# EAGLE design önlab (EAGLE 7.1.0)
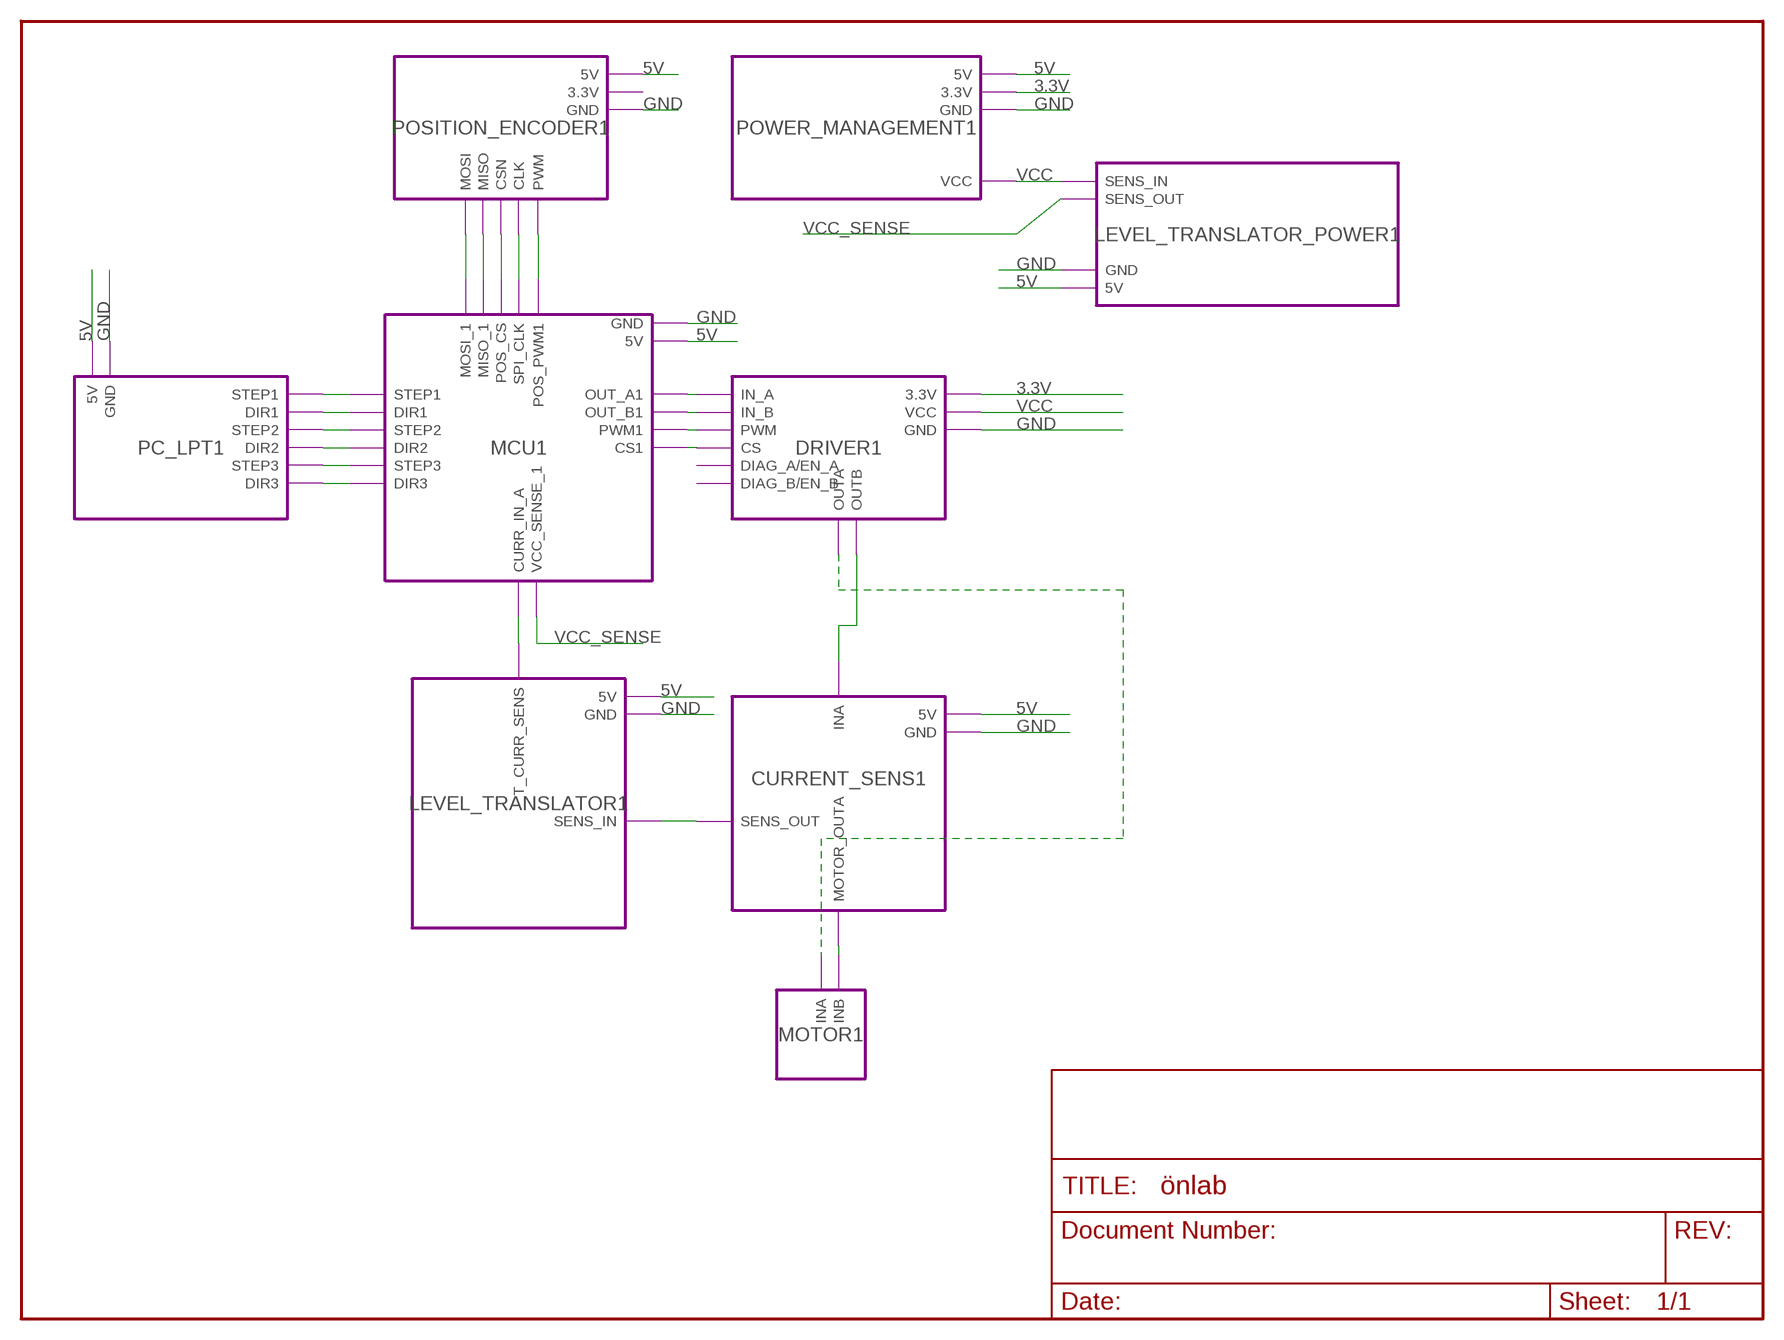
[diagram p0: schematic, sheet 1]

## Module instances
PC_LPT1 = PC_LPT
MCU1 = MCU
DRIVER1 = DRIVER
CURRENT_SENS1 = CURRENT_SENS
POSITION_ENCODER1 = POSITION_ENCODER
LEVEL_TRANSLATOR1 = LEVEL_TRANSLATOR
POWER_MANAGEMENT1 = POWER_MANAGEMENT
MOTOR1 = MOTOR
LEVEL_TRANSLATOR_POWER1 = LEVEL_TRANSLATOR_POWER

## Nets
3.3V: port POWER_MANAGEMENT1.3.3V DRIVER1.3.3V
5V: port POWER_MANAGEMENT1.5V LEVEL_TRANSLATOR_POWER1.5V POSITION_ENCODER1.5V CURRENT_SENS1.5V LEVEL_TRANSLATOR1.5V MCU1.5V PC_LPT1.5V
CS1: port DRIVER1.CS MCU1.CS1
GND: port POWER_MANAGEMENT1.GND LEVEL_TRANSLATOR_POWER1.GND POSITION_ENCODER1.GND CURRENT_SENS1.GND DRIVER1.GND LEVEL_TRANSLATOR1.GND MCU1.GND PC_LPT1.GND
N$1: port PC_LPT1.DIR3 MCU1.DIR3
N$2: port PC_LPT1.STEP3 MCU1.STEP3
N$3: port PC_LPT1.DIR2 MCU1.DIR2
N$4: port PC_LPT1.STEP2 MCU1.STEP2
N$5: port PC_LPT1.DIR1 MCU1.DIR1
N$6: port PC_LPT1.STEP1 MCU1.STEP1
N$7: port LEVEL_TRANSLATOR1.T_CURR_SENS MCU1.CURR_IN_A
N$8: port DRIVER1.OUTB CURRENT_SENS1.INA
N$9: port DRIVER1.OUTA MOTOR1.INA
N$10: port CURRENT_SENS1.MOTOR_OUTA MOTOR1.INB
N$14: port CURRENT_SENS1.SENS_OUT LEVEL_TRANSLATOR1.SENS_IN
N$16: port POSITION_ENCODER1.MISO MCU1.MISO_1
N$17: port POSITION_ENCODER1.CLK MCU1.SPI_CLK
N$19: port POSITION_ENCODER1.PWM MCU1.POS_PWM1
N$21: port MCU1.MOSI_1 POSITION_ENCODER1.MOSI
N$22: port MCU1.POS_CS POSITION_ENCODER1.CSN
OUT_A1: port MCU1.OUT_A1 DRIVER1.IN_A
OUT_B1: port MCU1.OUT_B1 DRIVER1.IN_B
PWM1: port MCU1.PWM1 DRIVER1.PWM
VCC: port POWER_MANAGEMENT1.VCC LEVEL_TRANSLATOR_POWER1.SENS_IN DRIVER1.VCC
VCC_SENSE: port LEVEL_TRANSLATOR_POWER1.SENS_OUT MCU1.VCC_SENSE_1

## Library data of the parts

## Module PC_LPT
Ports: STEP1(out) DIR1(out) STEP2(out) DIR2(out) STEP3(out) DIR3(out) 5V(pwr) GND(pwr)
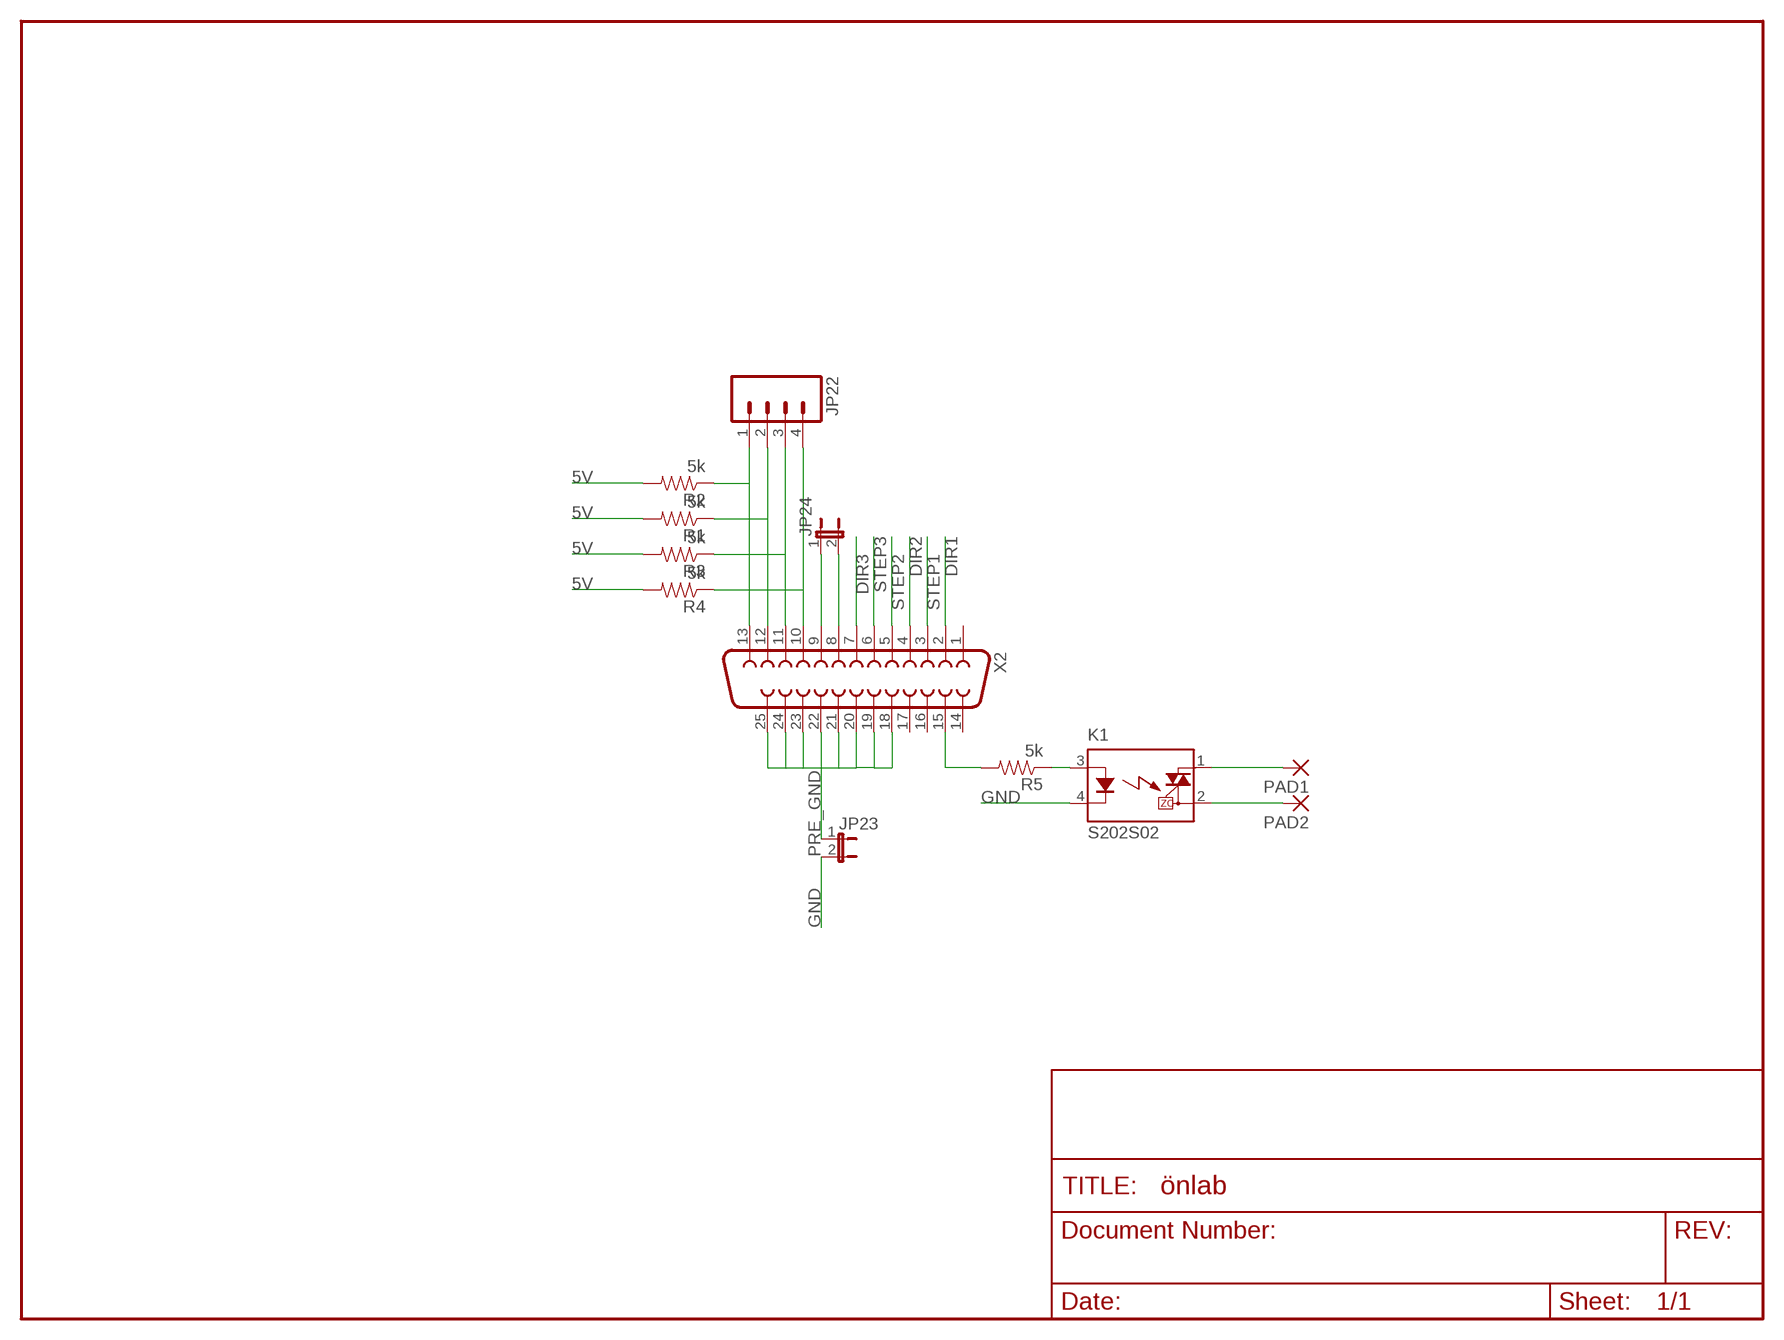
[diagram p1: schematic, module PC_LPT, sheet 1]

### Parts
JP22  M04PTH  [1X04]
JP23  JUMPER-2PTH  [1X02]
JP24  JUMPER-2PTH  [1X02]
K1  S202S02  [S202S02]
PAD1  3,81/1,1  [3,81/1,1]
PAD2  3,81/1,1  [3,81/1,1]
R1  5k  RESISTOR1206  [1206]
R2  5k  RESISTOR1206  [1206]
R3  5k  RESISTOR1206  [1206]
R4  5k  RESISTOR1206  [1206]
R5  5k  RESISTOR1206  [1206]
X2  F25H  [F25H]

### Nets
5V: R1.2 R2.2 R3.2 R4.2
DIR1: X2.2
DIR2: X2.4
DIR3: X2.7
GND: JP23.2 K1.4(K)
N$12: JP22.4 R4.1 X2.10
N$28: JP22.3 R3.1 X2.11
N$31: JP22.2 R1.1 X2.12
N$34: JP22.1 R2.1 X2.13
N$41: K1.3(A) R5.1
N$42: R5.2 X2.15
N$43: K1.2(DS2) PAD2.1(P)
N$44: K1.1(DS1) PAD1.1(P)
N$45: JP24.1 X2.9
N$46: JP24.2 X2.8
PRE_GND: JP23.1 X2.18 X2.19 X2.20 X2.21 X2.22 X2.23 X2.24 X2.25
STEP1: X2.3
STEP2: X2.5
STEP3: X2.6
Unconnected: X2.1 X2.14 X2.16 X2.17

### Library data of the parts
JP22 = SparkFun:M04: Header 4 Standard 4-pin 0.1" header. Use with straight break away headers (SKU : PRT-00116), right angle break away headers (PRT-00553), swiss pins (PRT-00743), machine pins (PRT-00117), and female headers (PRT-00115). Molex polarized connector foot print use with SKU : PRT-08231 with associated crimp pins and housings.
JP23 JP24 = SparkFun-Retired:JUMPER-2: Jumper Basic 0.1" spaced jumper. Use with breakaway headers.
K1 = relay:S*02S02: IT(rms) 8A, Zero Cross type SIP 4pin Triac output SSR Source: http://sharp-world.com/products/device/lineup/data/pdf/datasheet/s102s02_e.pdf
PAD1 PAD2 = wirepad:3,81/1,1: THROUGH-HOLE PAD
R1-R5 = SparkFun:RESISTOR: Resistor Basic schematic elements and footprints for 0603, 1206, and PTH 1/10th watt (small) resistors.
X2 = SparkFun-Connectors:F25: 25 Pin male connector. PCB edge mount for regular PCB thicknesses. This connector will connect directly to the back of a PC parallel port or through a normal DB25 extension cable (M/F). SKU: PRT-08287

## Module MCU
Ports: STEP1(in) DIR1(in) STEP2(in) DIR2(in) STEP3(in) DIR3(in) OUT_A1(out) OUT_B1(out) PWM1(out) CURR_IN_A(in) MOSI_1(out) MISO_1(in) SPI_CLK(out) POS_CS(out) VCC_SENSE_1(in) CS1(out) GND(pwr) 5V(pwr) POS_PWM1(in)
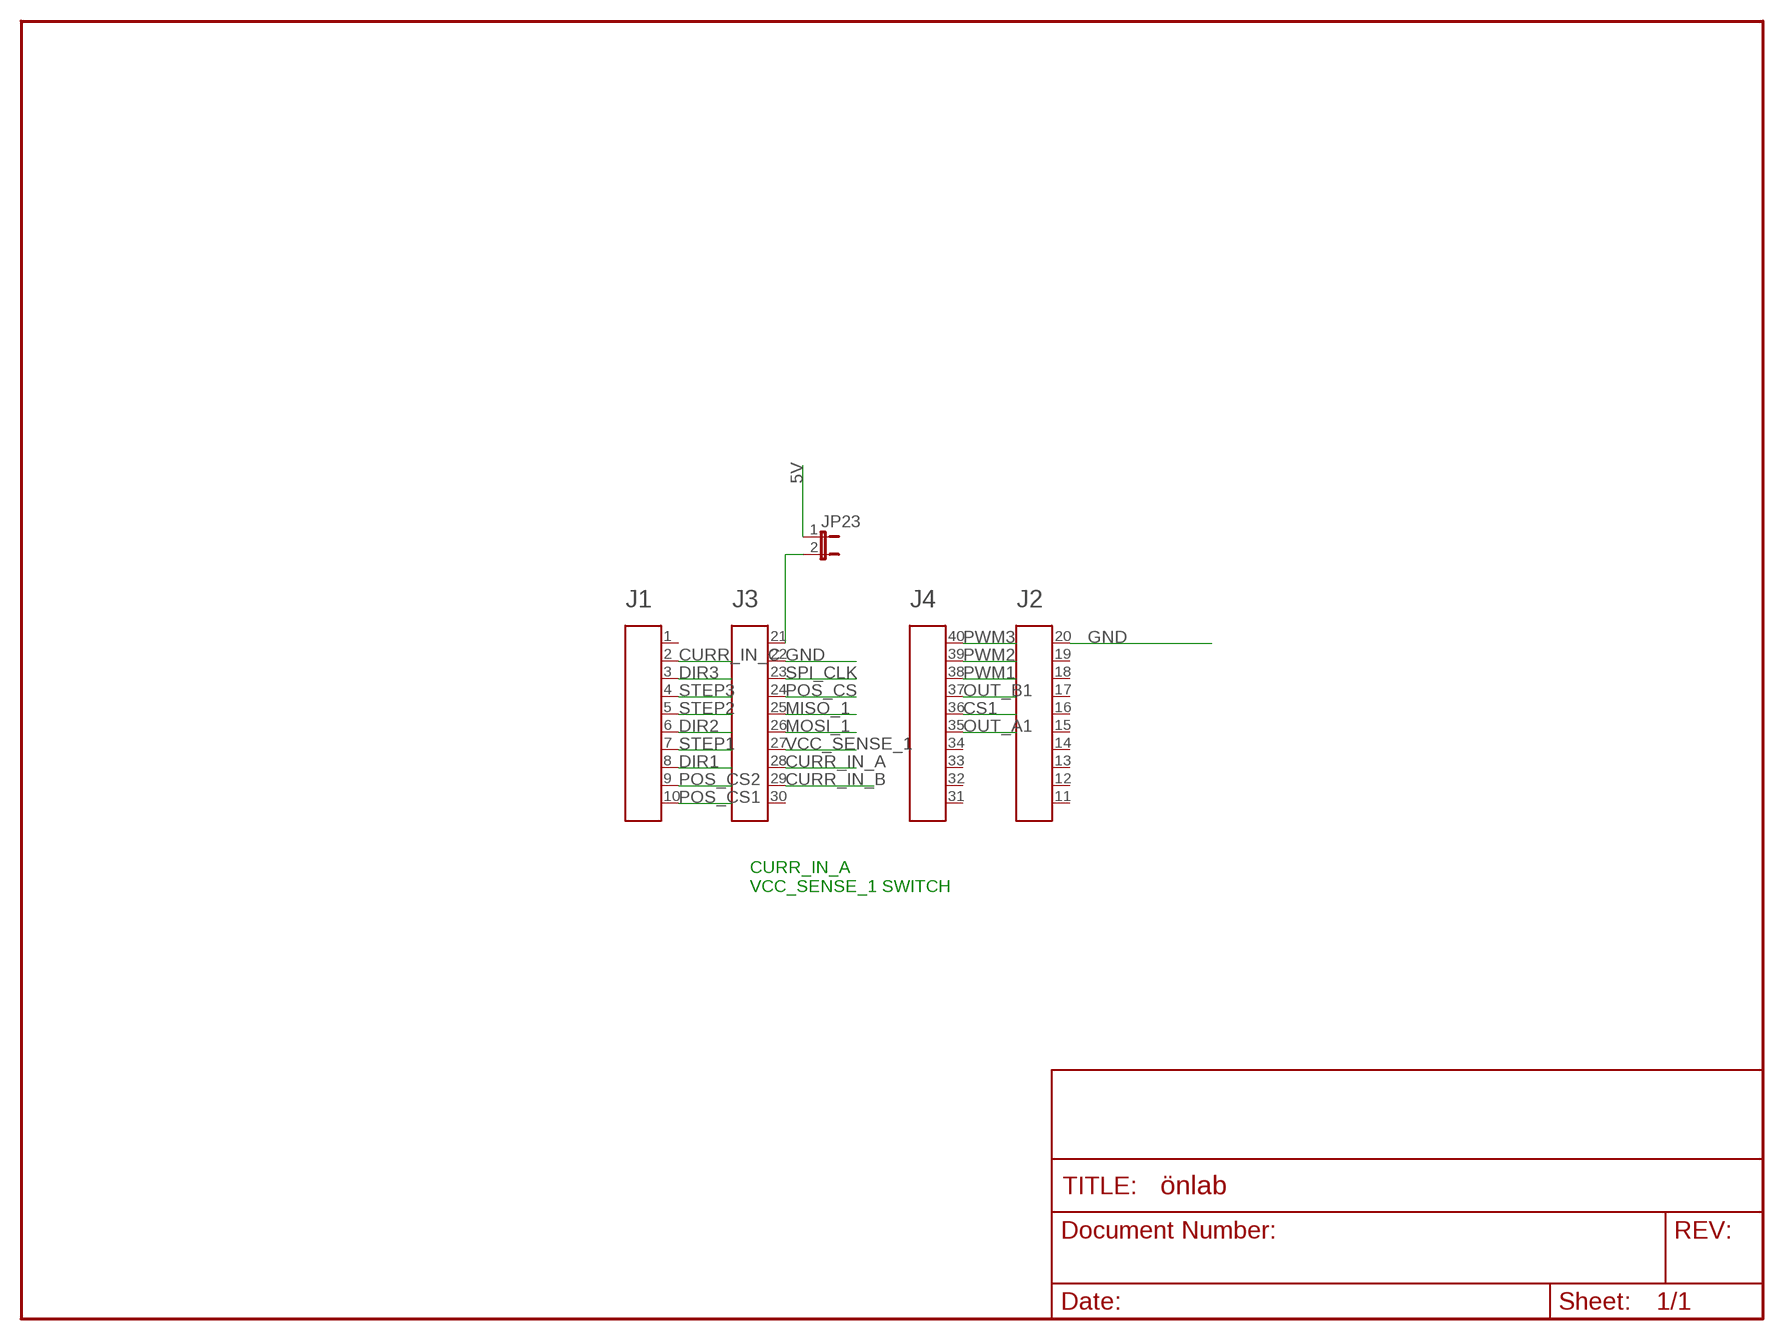
[diagram p2: schematic, module MCU, sheet 1]

### Parts
A1  HEADER4X10-BOOSTERPACK  [4X10-BOOSTERPACK]
JP23  JUMPER-2PTH  [1X02]

### Nets
5V: JP23.1
CS1: A1.36
CURR_IN_A: A1.28
CURR_IN_B: A1.29
CURR_IN_C: A1.2
DIR1: A1.8
DIR2: A1.6
DIR3: A1.3
GND: A1.20 A1.22
MISO_1: A1.25
MOSI_1: A1.26
N$1: A1.21 JP23.2
OUT_A1: A1.35
OUT_B1: A1.37
POS_CS: A1.24
POS_CS1: A1.10
POS_CS2: A1.9
PWM1: A1.38
PWM2: A1.39
PWM3: A1.40
SPI_CLK: A1.23
STEP1: A1.7
STEP2: A1.5
STEP3: A1.4
VCC_SENSE_1: A1.27
Unconnected: A1.1 A1.11 A1.12 A1.13 A1.14 A1.15 A1.16 A1.17 A1.18 A1.19 A1.30 A1.31 A1.32 A1.33 A1.34

### Notes on the sheet
- CURR_IN_A
  VCC_SENSE_1 SWITCH

### Library data of the parts
A1 = EAGLE_BoosterPack_Library:HEADER4X10-BOOSTERPACK
JP23 = SparkFun-Retired:JUMPER-2: Jumper Basic 0.1" spaced jumper. Use with breakaway headers.

## Module DRIVER
Ports: IN_A(in) IN_B(in) PWM(in) DIAG_A/EN_A(io) DIAG_B/EN_B(io) VCC(pwr) GND(pwr) OUTA(out) OUTB(out) 3.3V(pwr) CS(in)
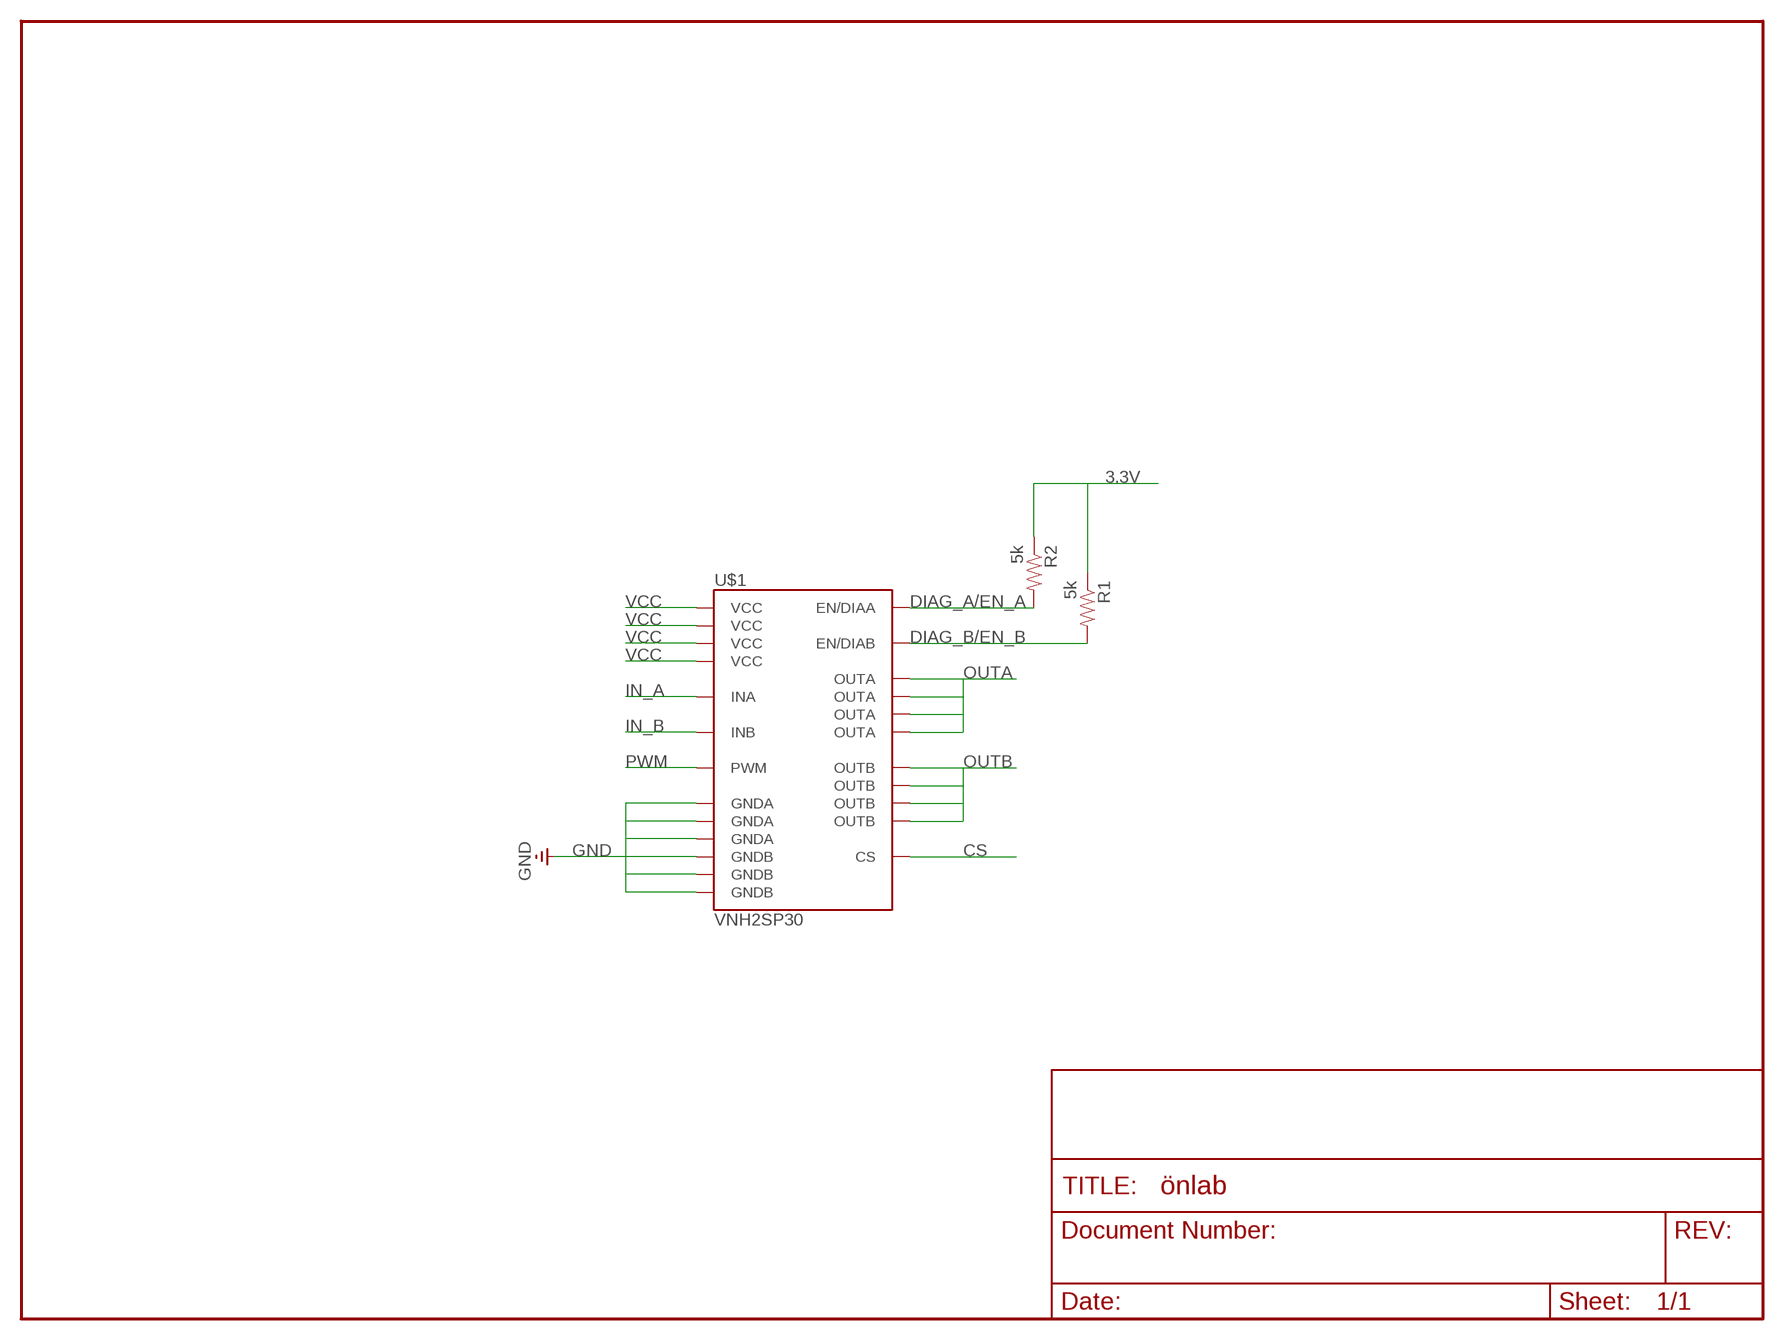
[diagram p3: schematic, module DRIVER, sheet 1]

### Parts
R1  5k  RESISTOR1206  [1206]
R2  5k  RESISTOR1206  [1206]
U$1  VNH2SP30  [VNH2SP30]

### Nets
3.3V: R1.1 R2.1
CS: U$1.9(CS)
DIAG_A/EN_A: R2.2 U$1.6(EN/DIAA)
DIAG_B/EN_B: R1.2 U$1.10(EN/DIAB)
GND: U$1.18(GNDB) U$1.19(GNDB) U$1.20(GNDB) U$1.26(GNDA) U$1.27(GNDA) U$1.28(GNDA)
IN_A: U$1.5(INA)
IN_B: U$1.11(INB)
OUTA: U$1.1(OUTA) U$1.25(OUTA) U$1.30(OUTA) U$1.SLUG3(OUTA)
OUTB: U$1.15(OUTB) U$1.16(OUTB) U$1.21(OUTB) U$1.SLUG2(OUTB)
PWM: U$1.8(PWM)
VCC: U$1.3(VCC) U$1.13(VCC) U$1.23(VCC) U$1.SLUG1(VCC)

### Library data of the parts
R1 R2 = SparkFun:RESISTOR: Resistor Basic schematic elements and footprints for 0603, 1206, and PTH 1/10th watt (small) resistors.
U$1 = SparkFun-PowerIC:VNH2SP30: 30A motor driver IC

## Module CURRENT_SENS
Ports: INA(in) MOTOR_OUTA(out) 5V(pwr) GND(pwr) SENS_OUT(out)
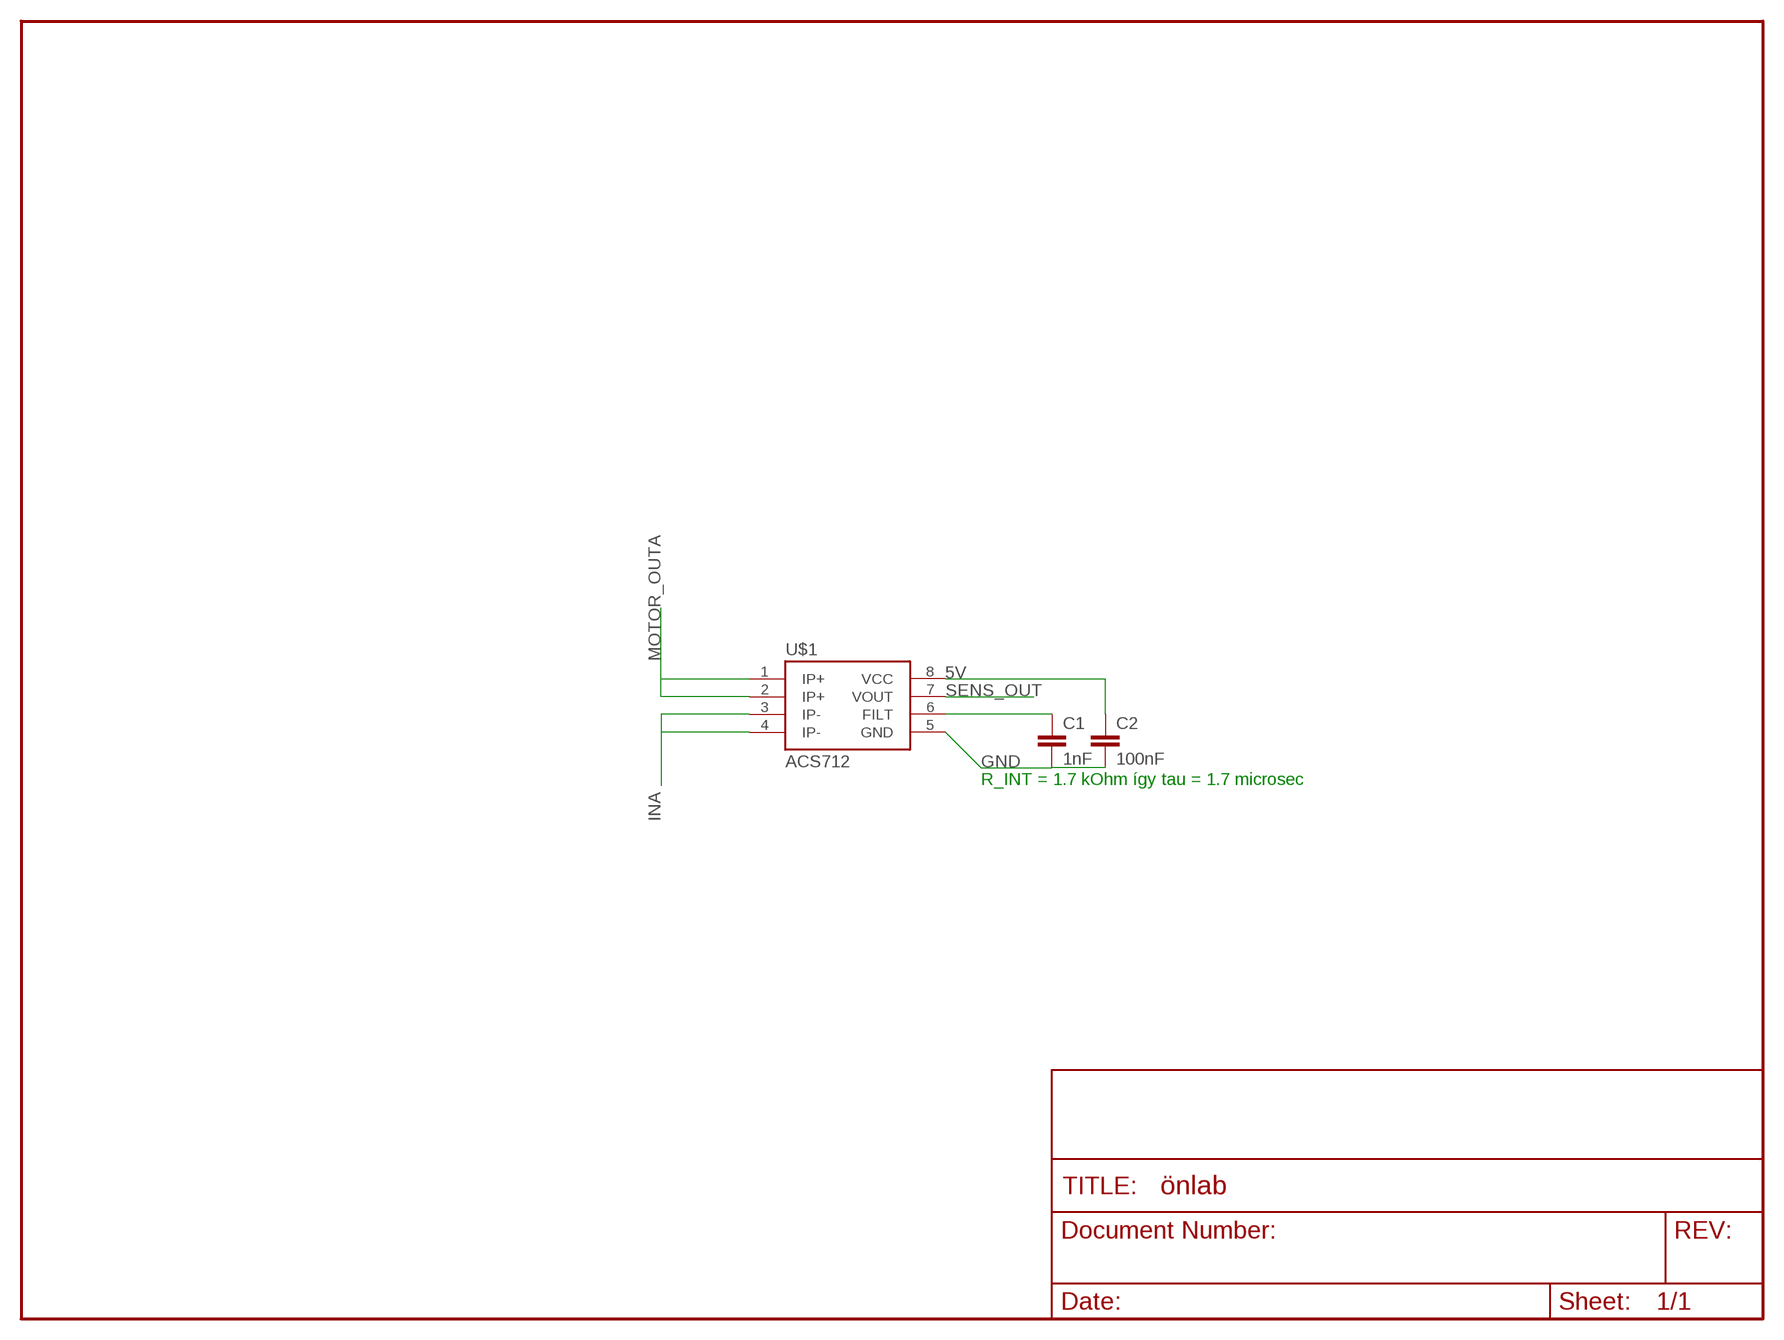
[diagram p4: schematic, module CURRENT_SENS, sheet 1]

### Parts
C1  1nF  CAP1206  [1206]
C2  100nF  CAP1206  [1206]
U$1  ACS712  [SO08]

### Nets
5V: C2.1 U$1.8(VCC)
GND: C1.2 C2.2 U$1.5(GND)
INA: U$1.3(IP-) U$1.4(IP-)
MOTOR_OUTA: U$1.1(IP+) U$1.2(IP+)
N$1: C1.1 U$1.6(FILT)
SENS_OUT: U$1.7(VOUT)

### Notes on the sheet
- R_INT = 1.7 kOhm így tau = 1.7 microsec

### Library data of the parts
C1 C2 = SparkFun-Passives:CAP: Capacitor Standard 0603 ceramic capacitor, and 0.1" leaded capacitor.
U$1 = SparkFun-AnalogIC:ACS712: Hall-effect-based isolated linear current sensor

## Module POSITION_ENCODER
Ports: 5V(pwr) 3.3V(pwr) GND(pwr) MOSI(in) MISO(out) CSN(in) CLK(in) PWM(out)
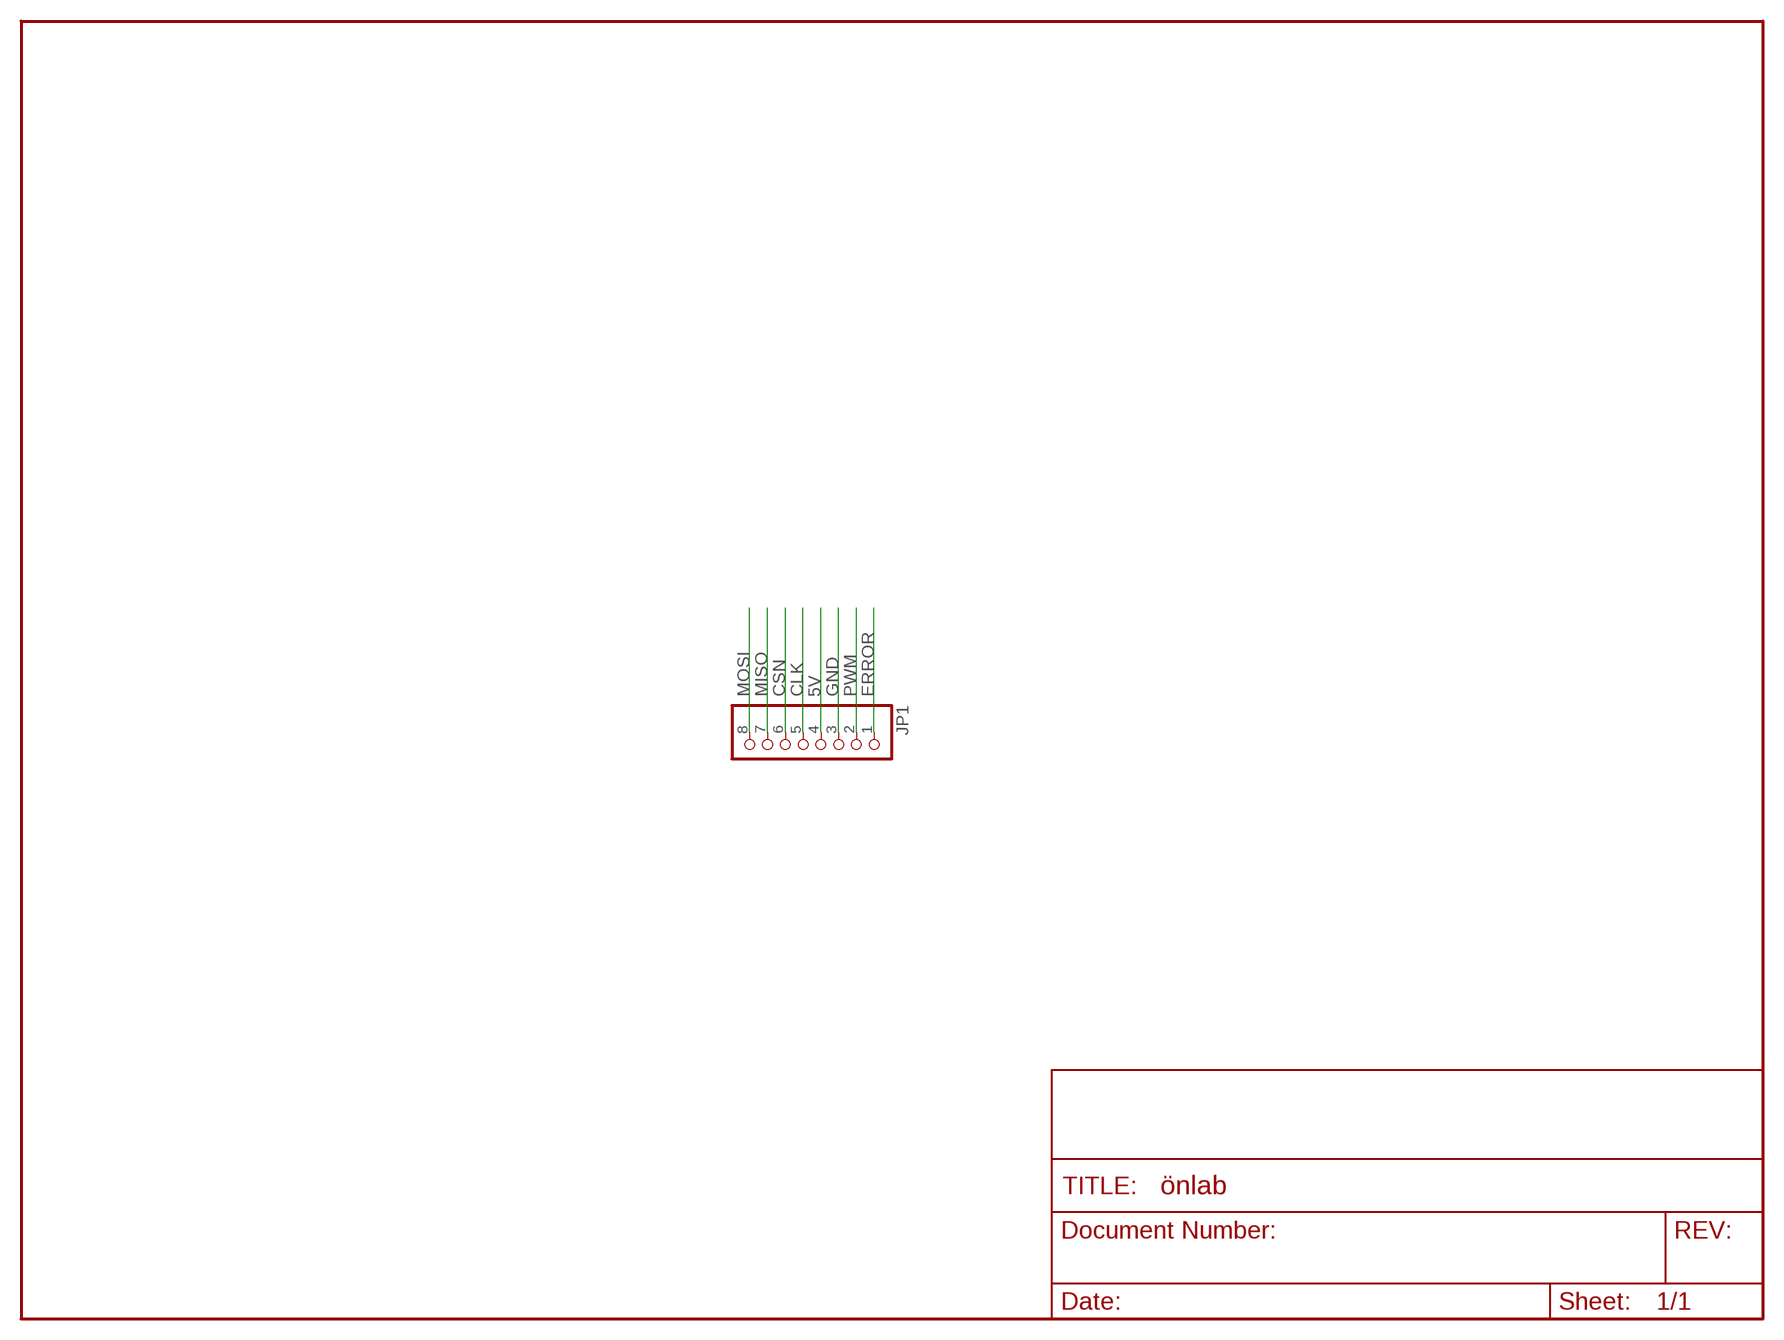
[diagram p5: schematic, module POSITION_ENCODER, sheet 1]

### Parts
JP1  PINHD-1X8M  [1X08M]

### Nets
5V: JP1.4
CLK: JP1.5
CSN: JP1.6
ERROR: JP1.1
GND: JP1.3
MISO: JP1.7
MOSI: JP1.8
PWM: JP1.2

### Library data of the parts
JP1 = pinhead:PINHD-1X8: PIN HEADER

## Module LEVEL_TRANSLATOR
Ports: 5V(pwr) GND(pwr) SENS_IN(in) T_CURR_SENS(out)
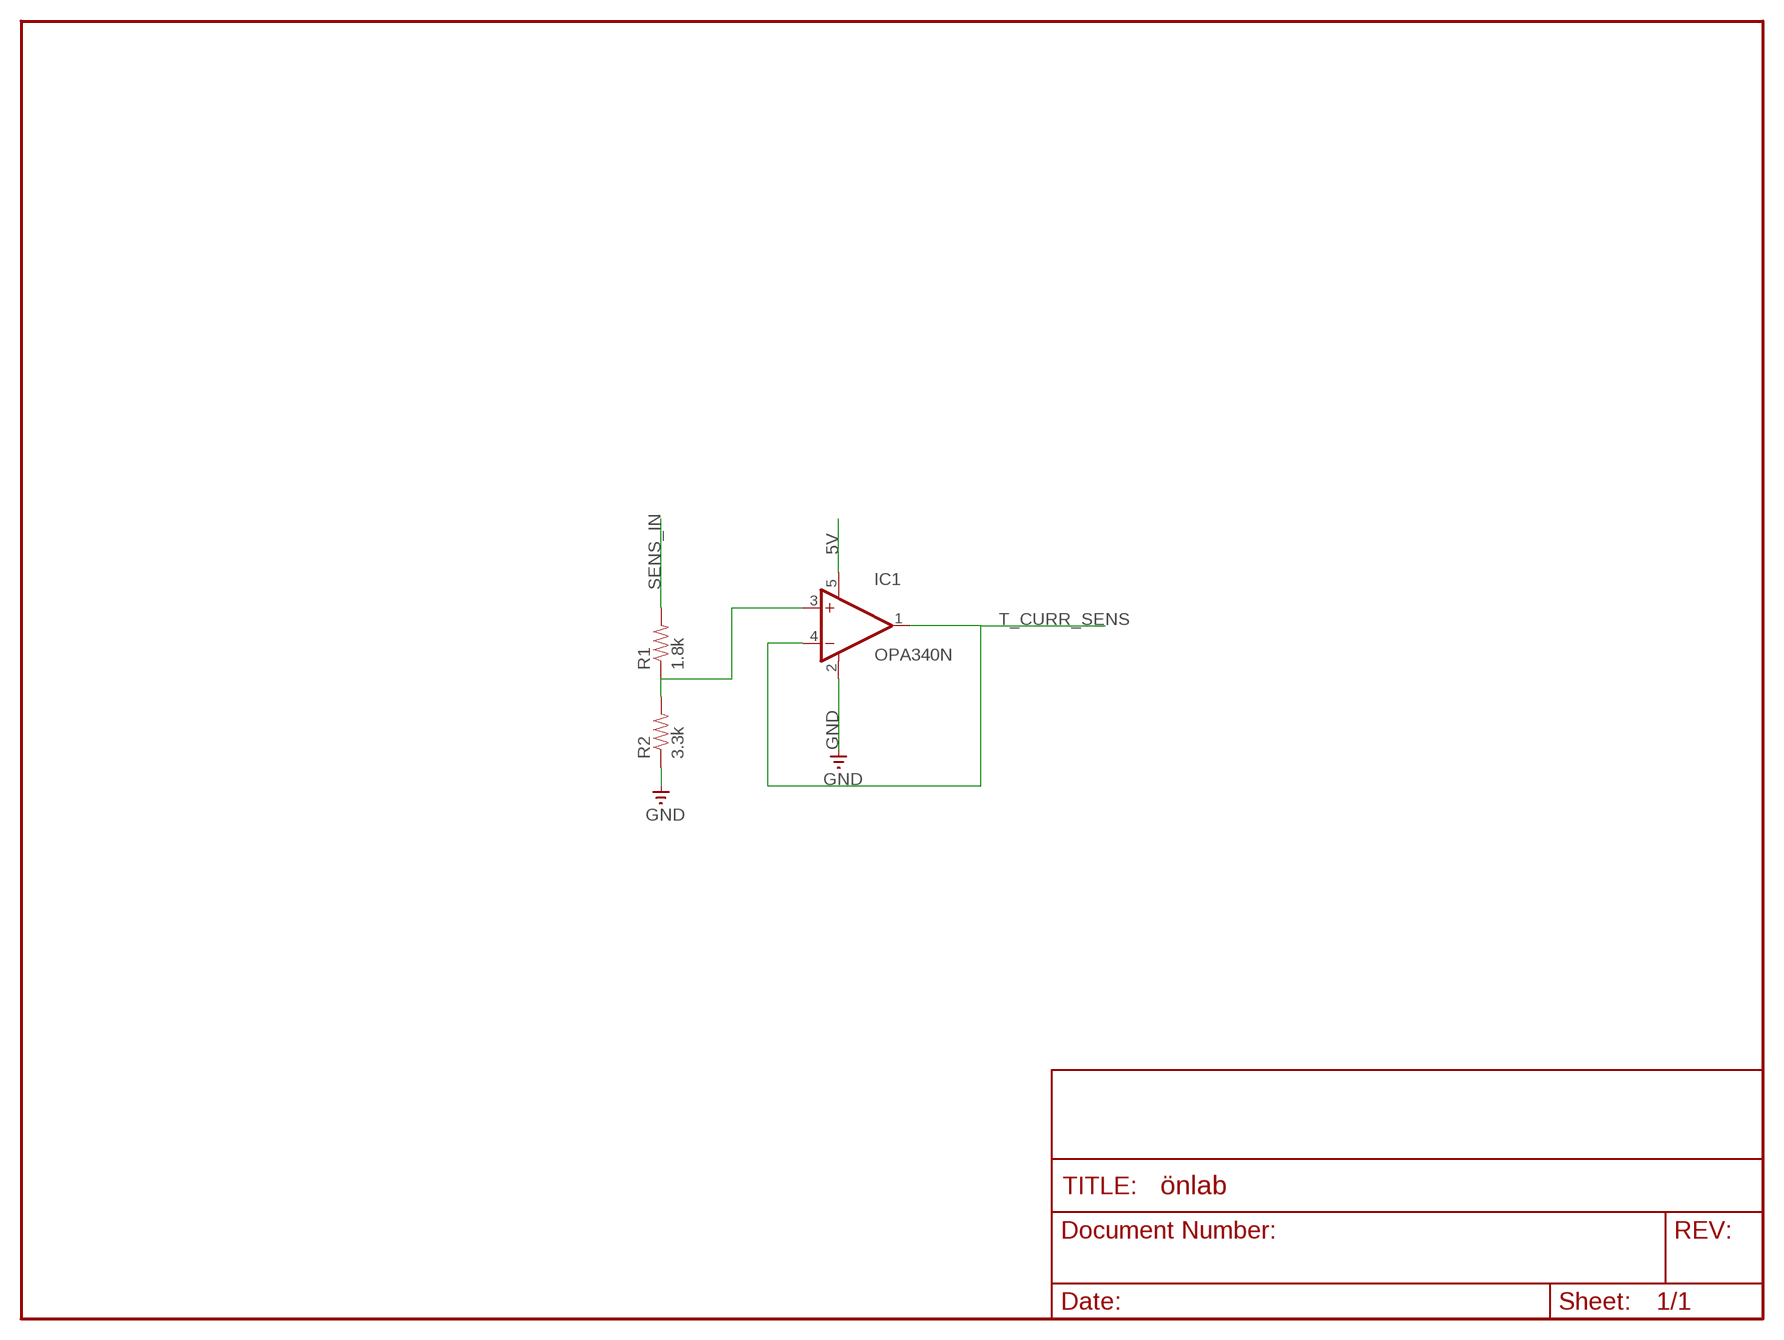
[diagram p6: schematic, module LEVEL_TRANSLATOR, sheet 1]

### Parts
IC1  OPA340N  [SOT23-5]
R1  1.8k  RESISTOR1206  [1206]
R2  3.3k  RESISTOR1206  [1206]

### Nets
5V: IC1.5(V+)
GND: IC1.2(V-) R2.1
N$1: IC1.3(+IN) R1.1 R2.2
SENS_IN: R1.2
T_CURR_SENS: IC1.1(OUT) IC1.4(-IN)

### Library data of the parts
IC1 = burr-brown:OPA340: Rail-to-Rail Operational Amplifiers Single-Supply, MicroAmplifier(TM) Series
R1 R2 = SparkFun:RESISTOR: Resistor Basic schematic elements and footprints for 0603, 1206, and PTH 1/10th watt (small) resistors.

## Module POWER_MANAGEMENT
Ports: 5V(pwr) 3.3V(pwr) GND(pwr) VCC(pwr)
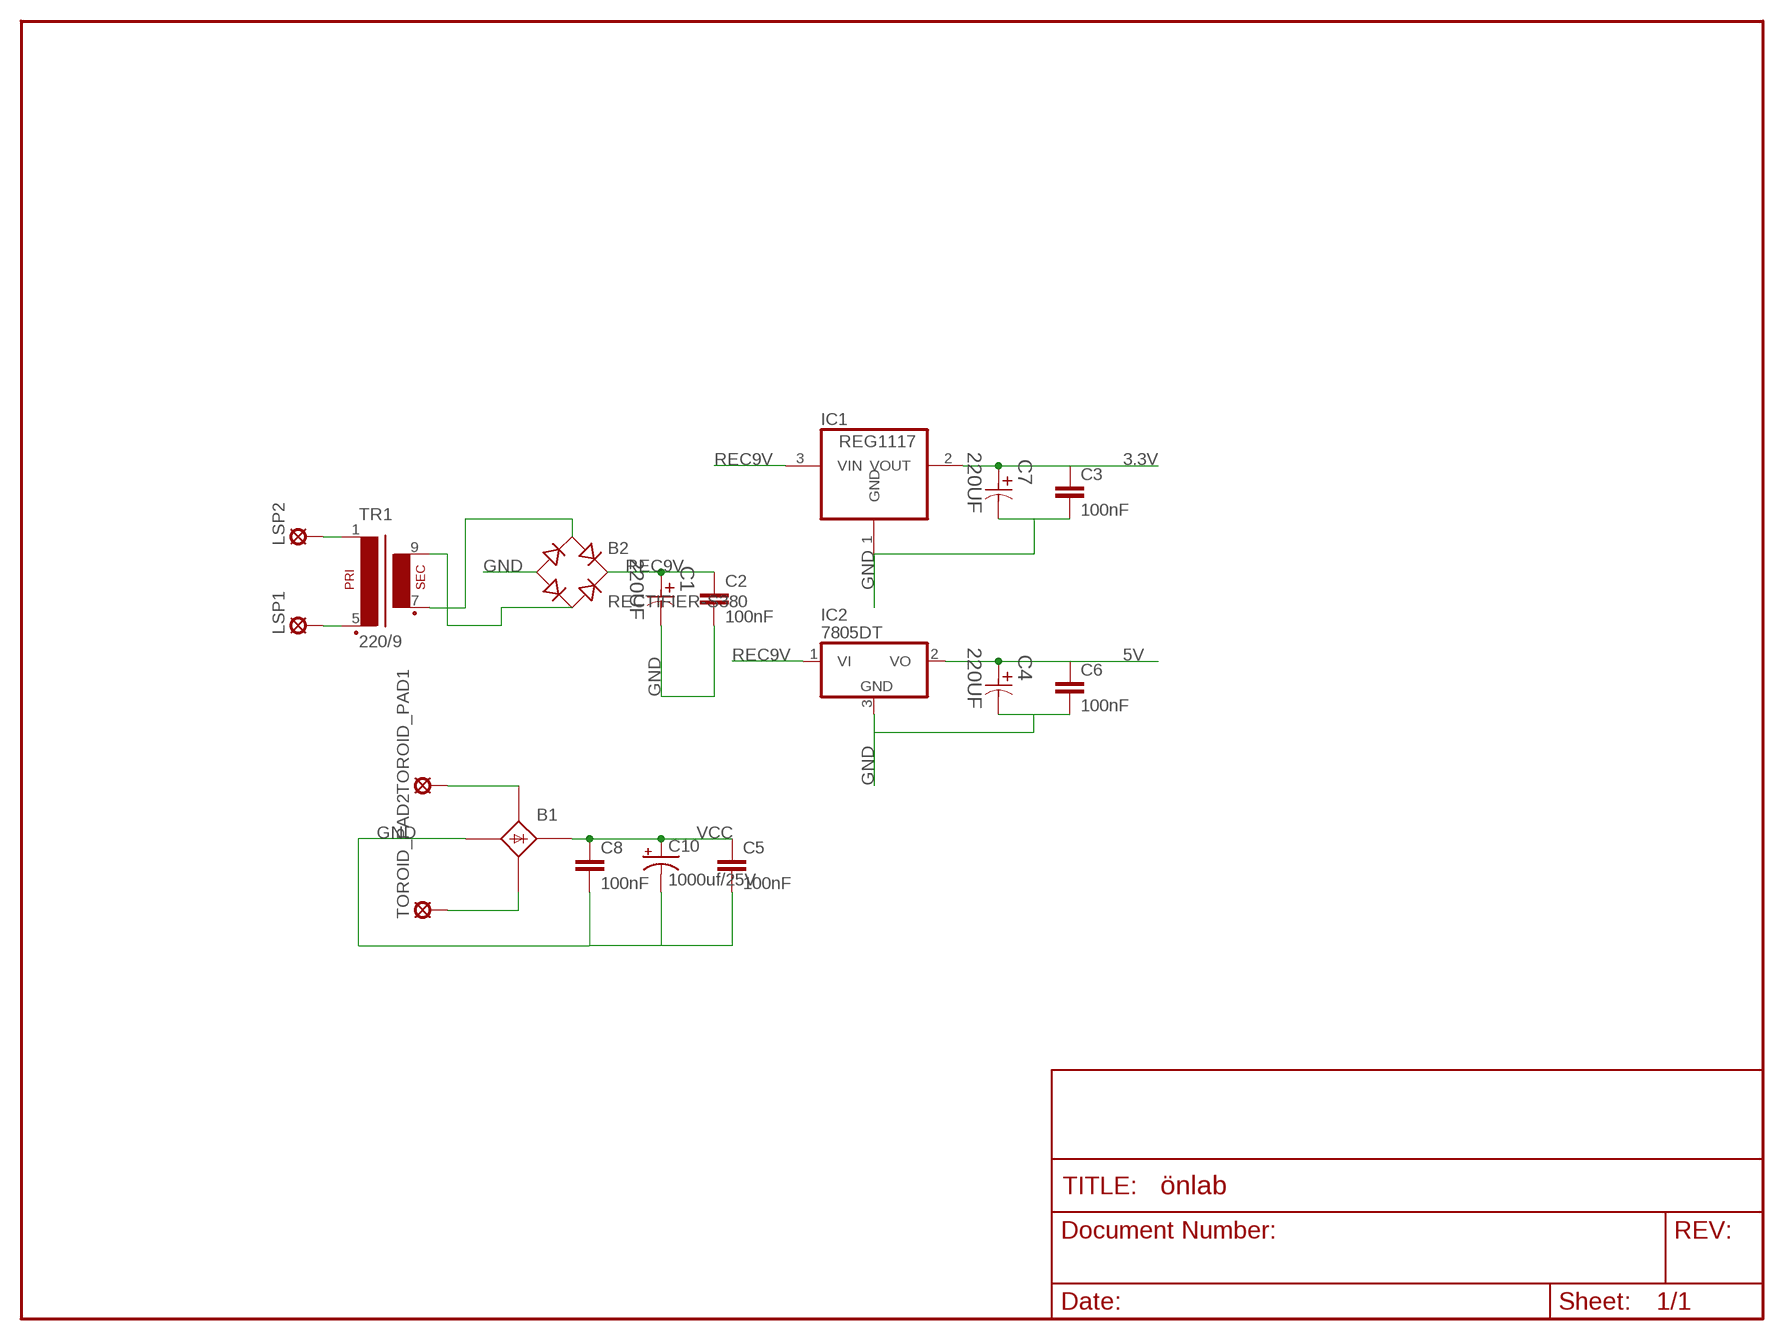
[diagram p7: schematic, module POWER_MANAGEMENT, sheet 1]

### Parts
B1  B25A-  [B25A-]
B2  RECTIFIER-S380  [TO-269AA]
C1  220UF  EEE-FK1C221P-CASE-E  [CAPAE830X650N]
C2  100nF  CAP1206  [1206]
C3  100nF  CAP1206  [1206]
C4  220UF  EEE-FK1C221P-CASE-E  [CAPAE830X650N]
C5  100nF  CAP1206  [1206]
C6  100nF  CAP1206  [1206]
C7  220UF  EEE-FK1C221P-CASE-E  [CAPAE830X650N]
C8  100nF  CAP1206  [1206]
C10  1000uf/25V  22000UF_ELCO_RM10KIT  [CPOL_RM10]
IC1  REG1117  [SOT223]
IC2  7805DT  [TO252]
LSP1  SE14  [SE14]
LSP2  SE14  [SE14]
TOROID_PAD1  SE14  [SE14]
TOROID_PAD2  SE14  [SE14]
TR1  220/9  EI30-1  [EI30-1]

### Nets
3.3V: C3.1 C7.1 IC1.2(VOUT)
5V: C4.1 C6.1 IC2.2(VO)
GND: B1.-1(-) B2.- C1.2 C2.2 C3.2 C4.2 C5.2 C6.2 C7.2 C8.2 C10.- IC1.1(GND) IC2.3(GND)
N$1: B1.AC2-(AC2) TOROID_PAD2.MP
N$2: B1.AC1-(AC1) TOROID_PAD1.MP
N$3: B2.AC1 TR1.7(S3)
N$4: B2.AC2 TR1.9(S4)
N$7: LSP2.MP TR1.1
N$8: LSP1.MP TR1.5(P2)
REC9V: B2.+ C1.1 C2.1 IC1.3(VIN) IC2.1(VI)
VCC: B1.+1(+) C5.1 C8.1 C10.+
Unconnected: B1.+ B1.- B1.AC1 B1.AC2

### Library data of the parts
B1 = rectifier:B25A-: RECTIFIER 25-A bridge
B2 = rectifier:RECTIFIER-: Rectifier
C1 C4 C7 = Panasonic-EEEFK_EEEFP:EEE-: Aluminum Electrolytic Capacitors,Surface Mount Type; MPN: EEE-FK1C221P; OC_FARNELL: 9695680; OC_NEWARK: 96K9382; PACKAGE: CASE-E; SUPPLIER: PANASONIC; TOLERANCE: ±20 %; VOLTAGERATING: 16V
C2 C3 C5 C6 C8 = SparkFun-Capacitors:CAP: Capacitor Standard 0603 ceramic capacitor, and 0.1" leaded capacitor.
C10 = forCNC:22000UF_ELCO_RM10: CAP-08070; PROD_ID: CAP-09538
IC1 = burr-brown-3:REG1117: 800mA and 1A Low Dropout (LDO) Positive Regulator 1.8V, 2.5V, 2.85V, 3.3V, 5V, and Adj
IC2 = linear4:78*: Positive VOLTAGE REGULATOR
LSP1 LSP2 TOROID_PAD1 TOROID_PAD2 = solpad:SE14: SOLDER PAD E1553, drill 1,4mm, distributor Buerklin, 07F820
TR1 = trafo:EI30-1: TRANSFORMER 1 primary winding, 1 secondary winding ERA

## Module MOTOR
Ports: INA(in) INB(in)
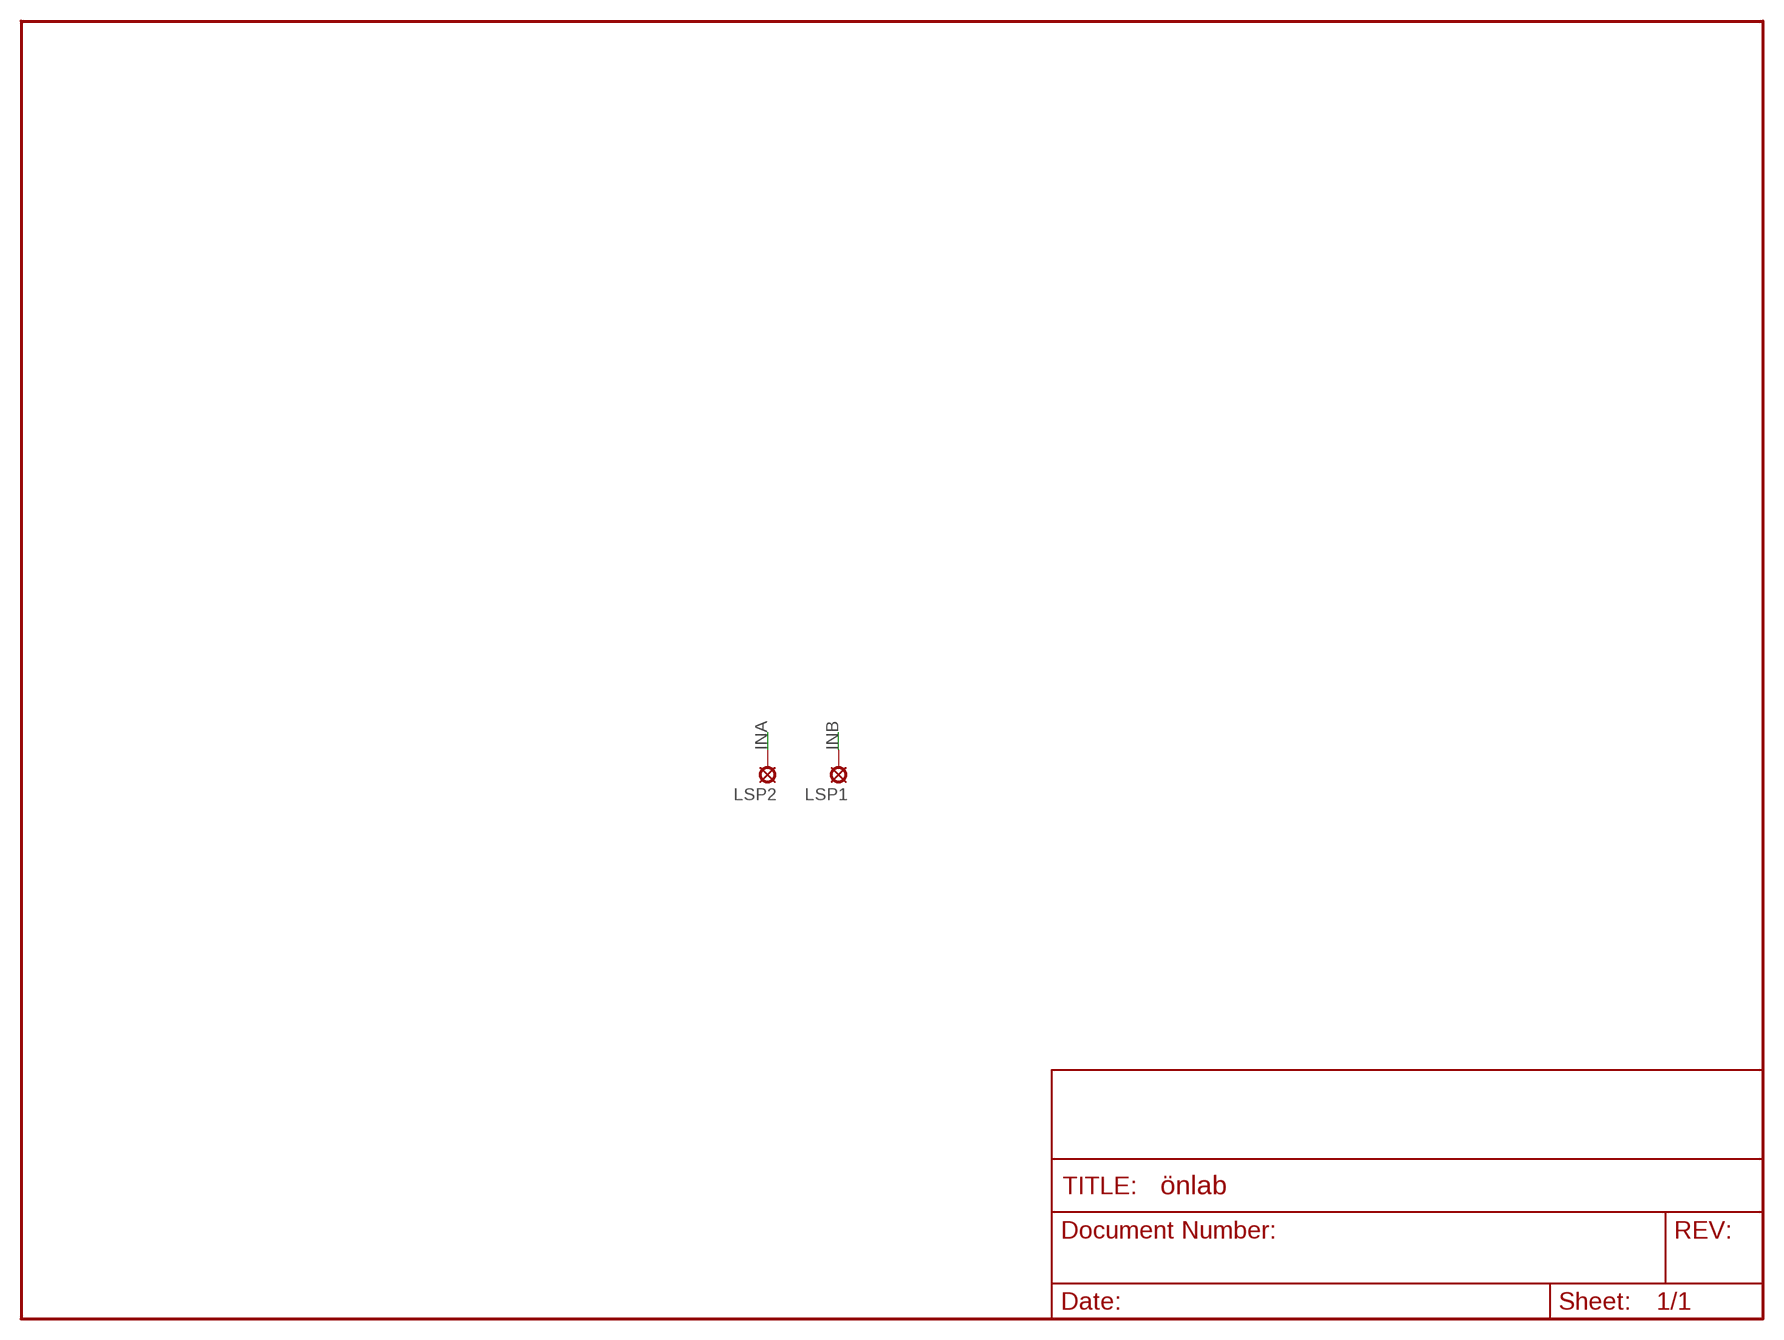
[diagram p8: schematic, module MOTOR, sheet 1]

### Parts
LSP1  SE14  [SE14]
LSP2  SE14  [SE14]

### Nets
INA: LSP2.MP
INB: LSP1.MP

### Library data of the parts
LSP1 LSP2 = solpad:SE14: SOLDER PAD E1553, drill 1,4mm, distributor Buerklin, 07F820

## Module LEVEL_TRANSLATOR_POWER
Ports: SENS_IN(in) GND(pwr) 5V(pwr) SENS_OUT(out)
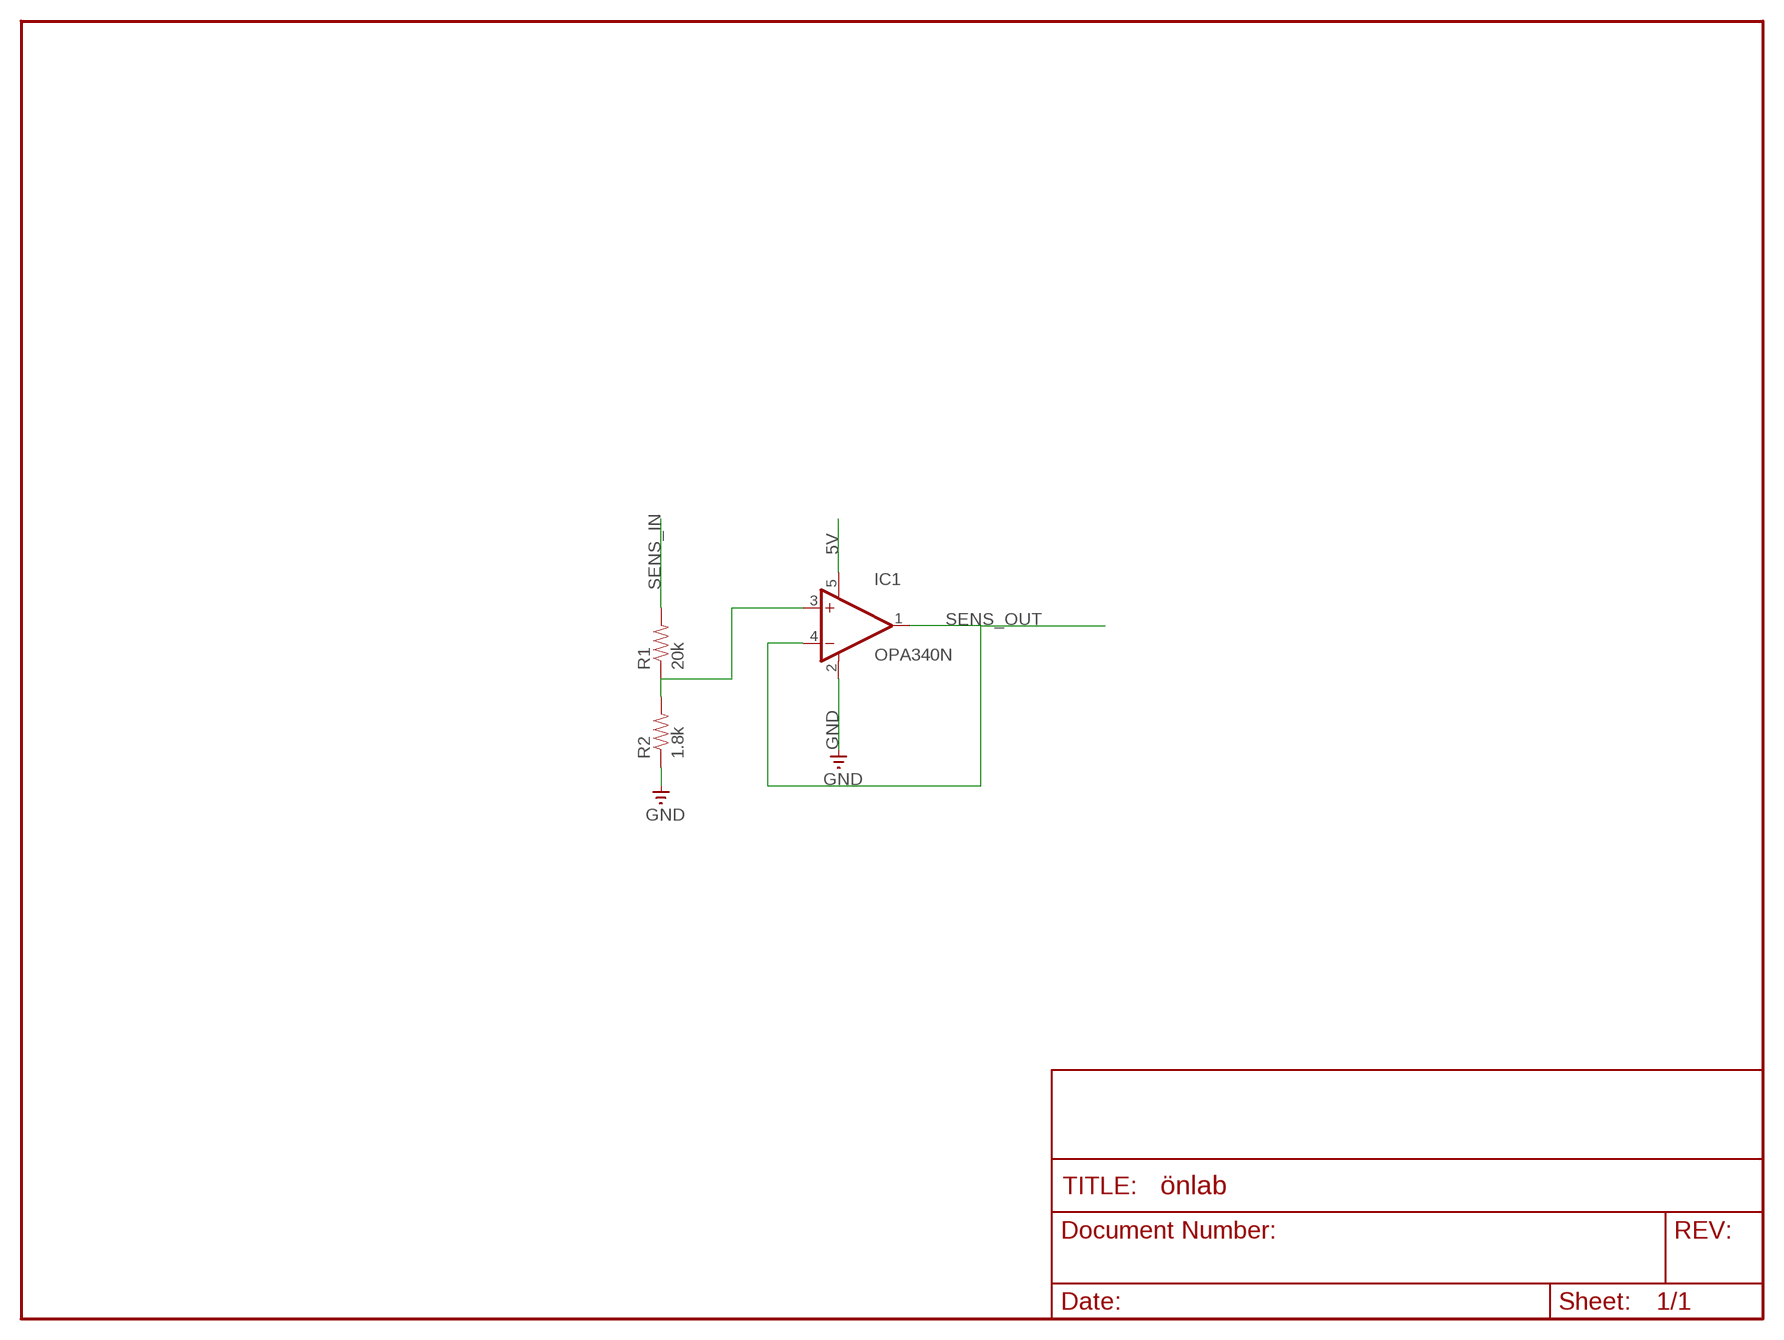
[diagram p9: schematic, module LEVEL_TRANSLATOR_POWER, sheet 1]

### Parts
IC1  OPA340N  [SOT23-5]
R1  20k  RESISTOR1206  [1206]
R2  1.8k  RESISTOR1206  [1206]

### Nets
5V: IC1.5(V+)
GND: IC1.2(V-) R2.1
N$1: IC1.3(+IN) R1.1 R2.2
SENS_IN: R1.2
SENS_OUT: IC1.1(OUT) IC1.4(-IN)

### Library data of the parts
IC1 = burr-brown:OPA340: Rail-to-Rail Operational Amplifiers Single-Supply, MicroAmplifier(TM) Series
R1 R2 = SparkFun:RESISTOR: Resistor Basic schematic elements and footprints for 0603, 1206, and PTH 1/10th watt (small) resistors.

## Board
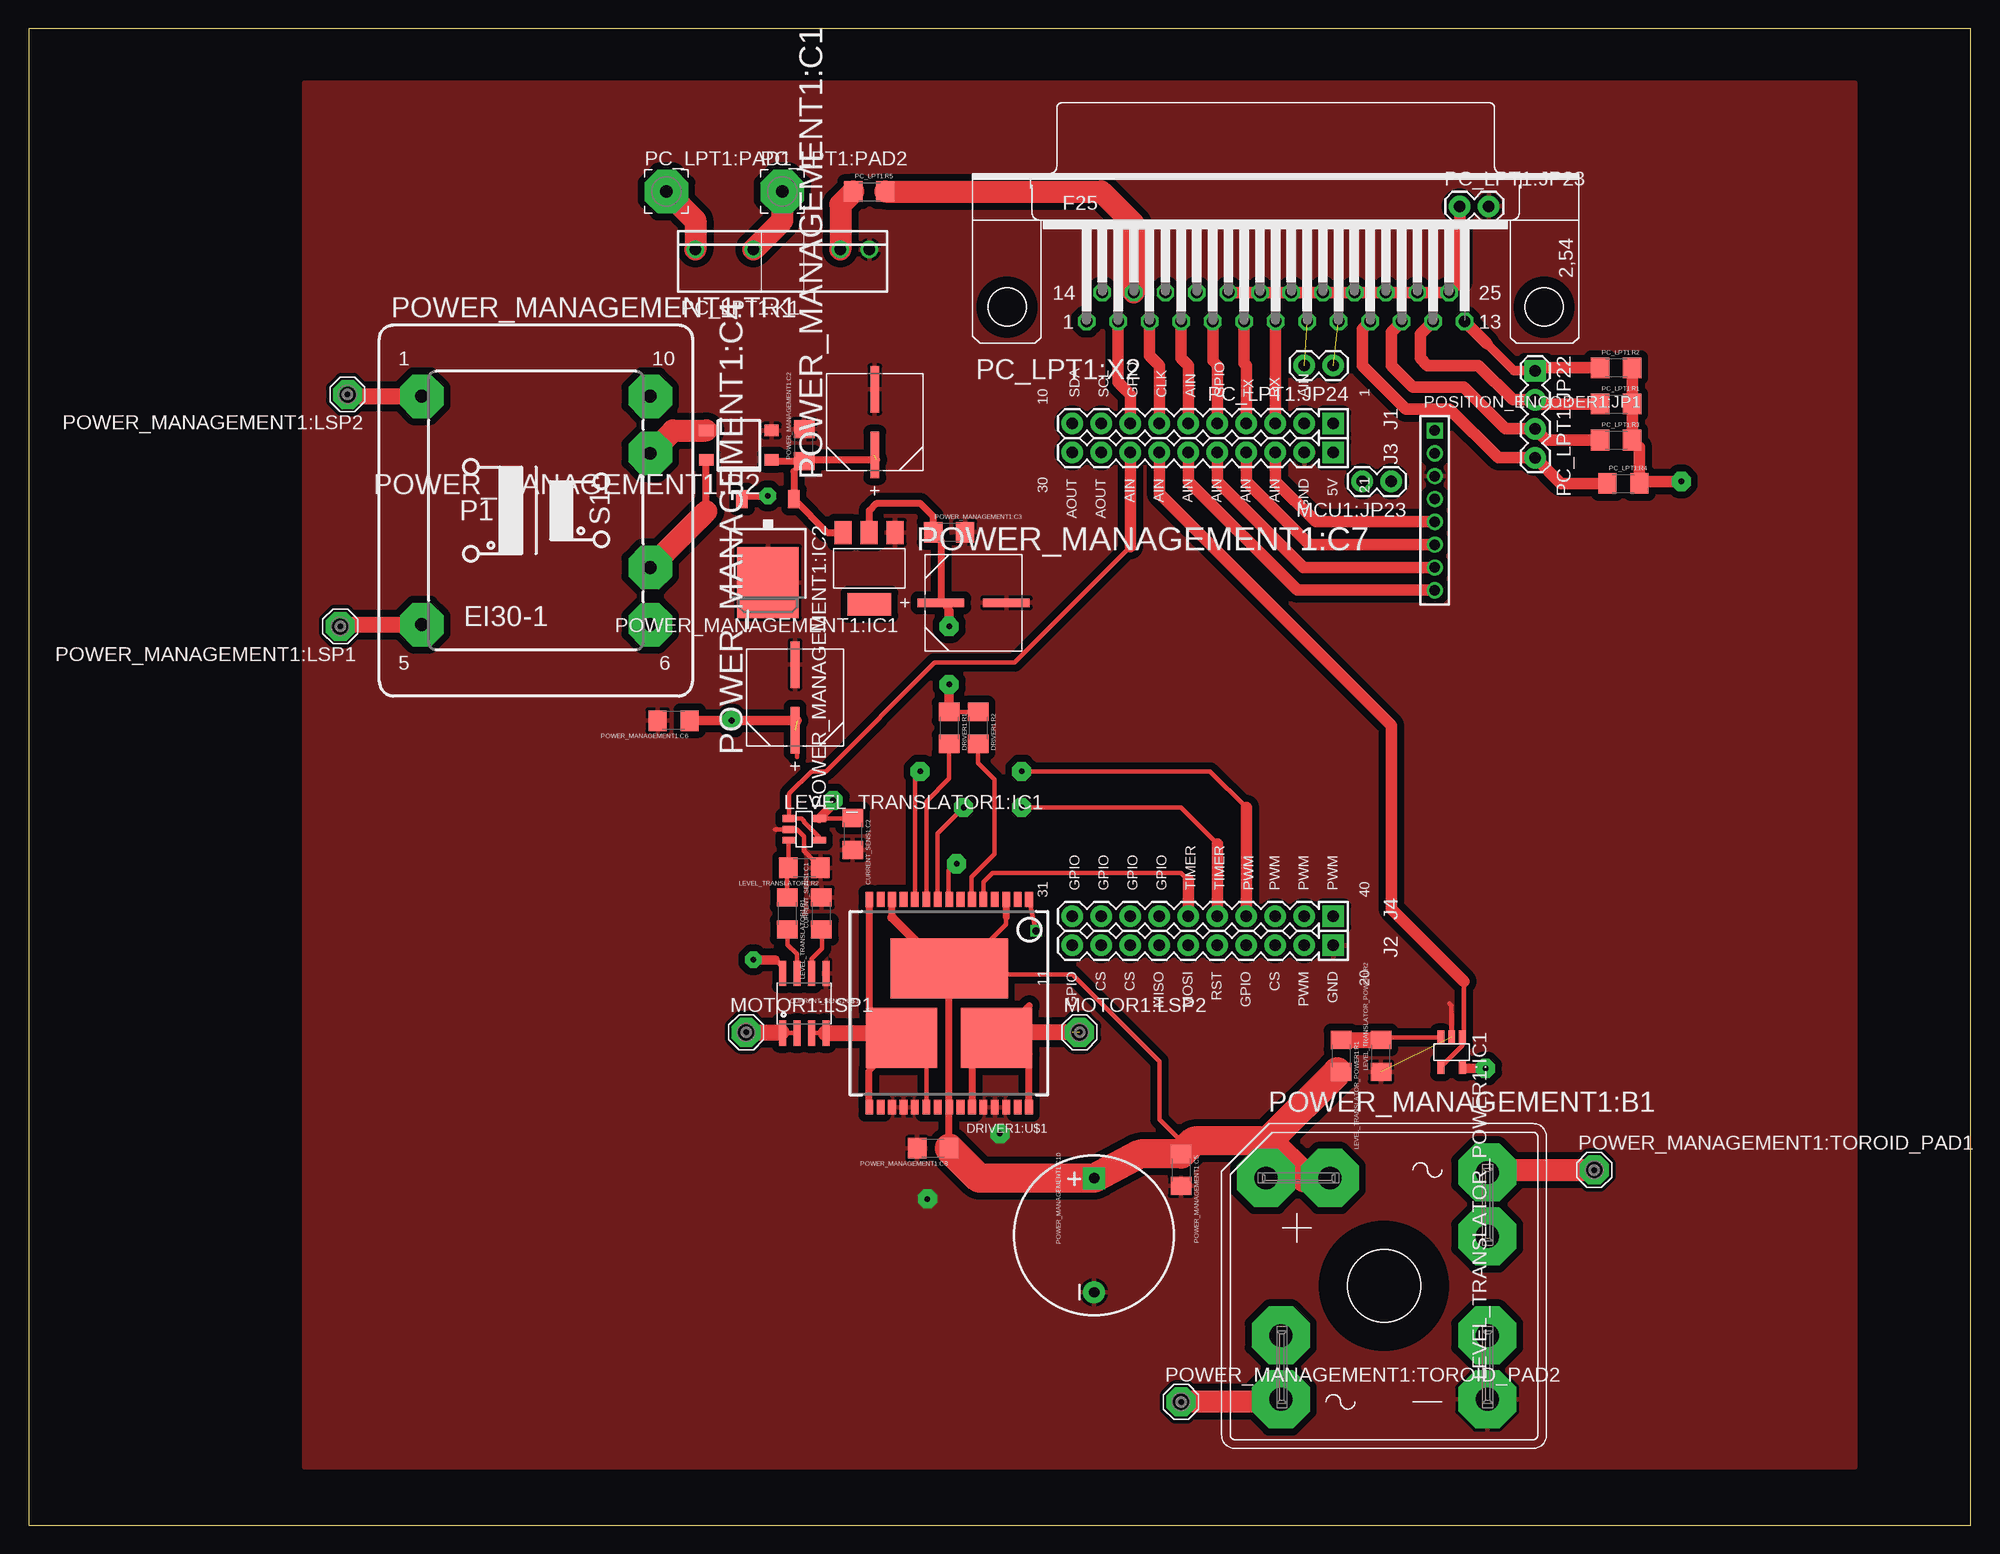
[diagram p10: board, top side]
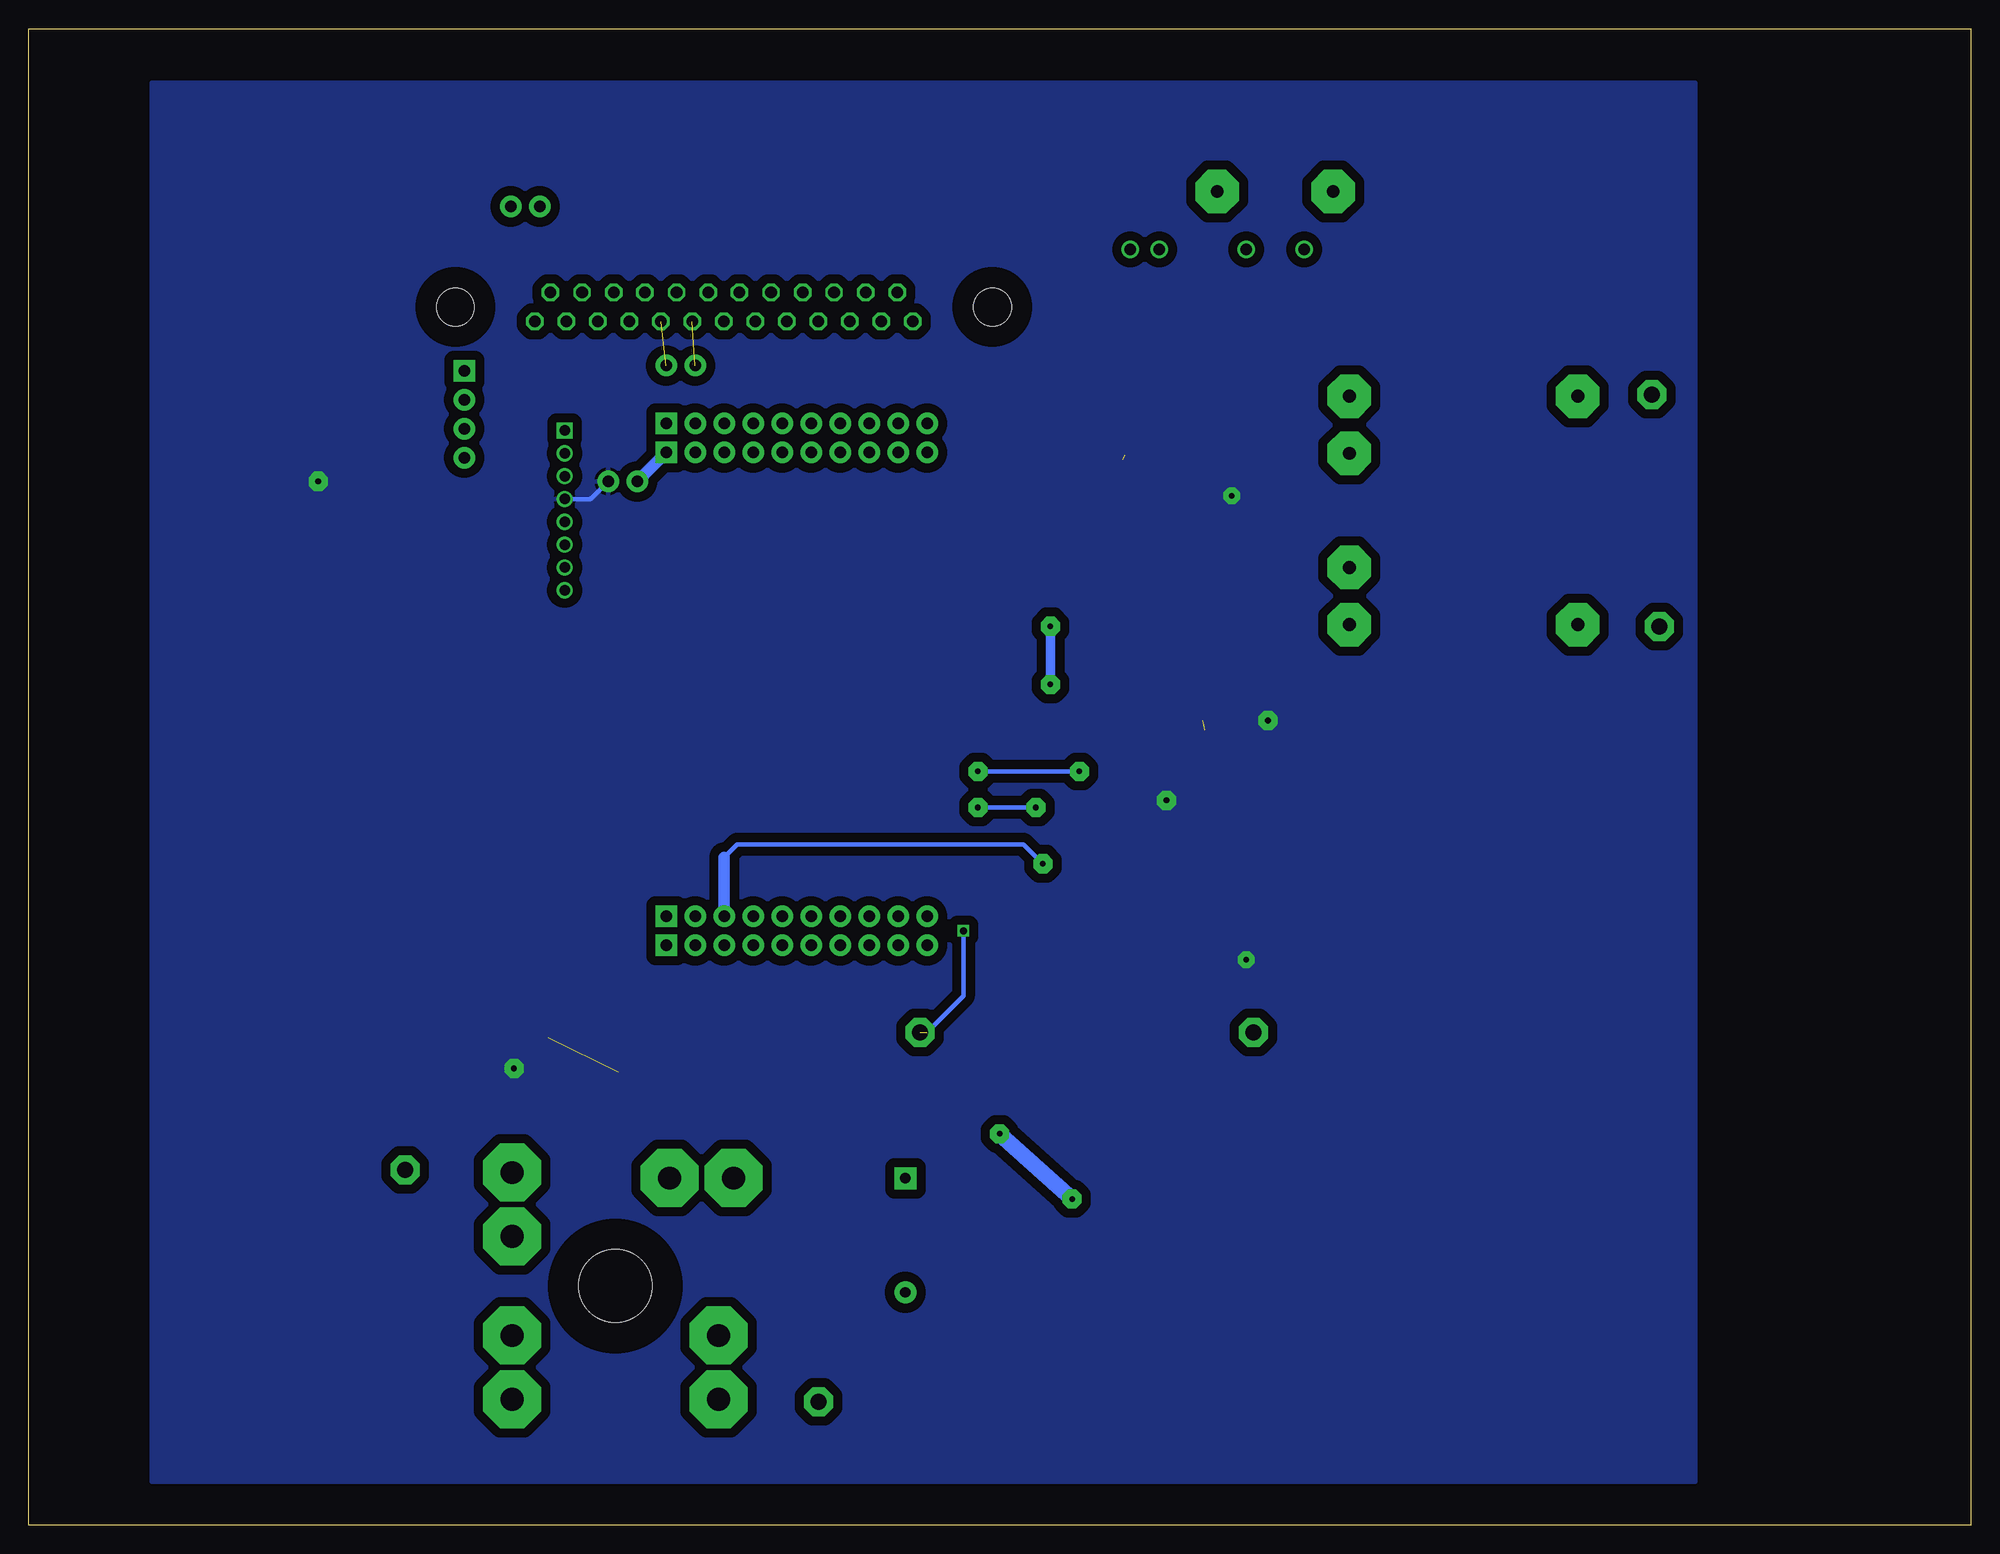
[diagram p11: board, bottom side, seen from below]

Size 170.16 x 131.12 mm. Coordinates in mm from the lower left corner, seen from the top.
Outline: 0,0 170.16,0 170.16,131.12 0,131.12 0,0
Copper layers (1*16): Top 0.035mm / dielectric 1.5mm / Bottom 0.035mm
Design rules "default": minimum track width 10mil, minimum drill 24mil, track to track 8mil, track to pad 8mil, pad to pad 8mil, via to via 8mil, smd to smd 8mil, copper to edge 40mil, drill to drill 8mil, minimum pad ring 10mil, minimum via ring 8mil, stop-mask expansion 4mil, vias tented up to drill 0mil, thermal gap 10mil

### Footprints (pad centres in the part's own frame; a part is rotated, then mirrored left to right if it is on the bottom)
1206 = smd 1.6 x 1.8: 1 -1.4,0; 2 1.4,0
SO08 = smd 0.61 x 2.21: 1 -1.905,-2.616; 2 -0.635,-2.616; 3 0.635,-2.616; 4 1.905,-2.616; 5 1.905,2.616; 6 0.635,2.616; 7 -0.635,2.616; 8 -1.905,2.616
VNH2SP30 = smd 0.67 x 1.3: 1 -7,-9.1; 2 -6,-9.1; 3 -5,-9.1; 4 -4,-9.1; 5 -3,-9.1; 6 -2,-9.1; 7 -1,-9.1; 8 0,-9.1; 9 1,-9.1; 10 2,-9.1; 11 3,-9.1; 12 4,-9.1; 13 5,-9.1; 14 6,-9.1; 15 7,-9.1; 16 7,9.1; 17 6,9.1; 18 5,9.1; 19 4,9.1; 20 3,9.1; 21 2,9.1; 22 1,9.1; 23 0,9.1; 24 -1,9.1; 25 -2,9.1; 26 -3,9.1; 27 -4,9.1; 28 -5,9.1; 29 -6,9.1; 30 -7,9.1 | smd 10.3 x 5.25: SLUG1 0,-3.05 | smd 6.23 x 5.25: SLUG2 4.165,3.05; SLUG3 -4.165,3.05
SOT23-5 = smd 0.6 x 1.2: 1 -0.95,-1.306; 2 0,-1.306; 3 0.95,-1.306; 4 0.95,1.306; 5 -0.95,1.306
4X10-BOOSTERPACK = drill 1.016 pad 1.88 square: 1 0,10.16; 20 45.72,10.16; 21 2.54,10.16; 40 43.18,10.16 | drill 1.016 pad 1.88: 2 0,7.62; 3 0,5.08; 4 0,2.54; 5 0,0; 6 0,-2.54; 7 0,-5.08; 8 0,-7.62; 9 0,-10.16; 10 0,-12.7; 11 45.72,-12.7; 12 45.72,-10.16; 13 45.72,-7.62; 14 45.72,-5.08; 15 45.72,-2.54; 16 45.72,0; 17 45.72,2.54; 18 45.72,5.08; 19 45.72,7.62; 22 2.54,7.62; 23 2.54,5.08; 24 2.54,2.54; 25 2.54,0; 26 2.54,-2.54; 27 2.54,-5.08; 28 2.54,-7.62; 29 2.54,-10.16; 30 2.54,-12.7; 31 43.18,-12.7; 32 43.18,-10.16; 33 43.18,-7.62; 34 43.18,-5.08; 35 43.18,-2.54; 36 43.18,0; 37 43.18,2.54; 38 43.18,5.08; 39 43.18,7.62
1X02 = drill 1.016 pad 1.88: 1 0,0; 2 2.54,0
SE14 = drill 1.397 pad 2.54 octagon: MP 0,0
1X04 = drill 1.016 pad 1.88 square: 1 0,0 | drill 1.016 pad 1.88: 2 2.54,0; 3 5.08,0; 4 7.62,0
S202S02 = drill 1: 1 -7.62,0; 2 -2.54,0; 3 5.08,0; 4 7.62,0
3,81/1,1 = drill 1.118 pad 3.81 octagon: 1 0,0
F25H = drill 1.016 octagon: 1 -16.561,-1.27; 2 -13.792,-1.27; 3 -11.049,-1.27; 4 -8.28,-1.27; 5 -5.512,-1.27; 6 -2.769,-1.27; 7 0,-1.27; 8 2.769,-1.27; 9 5.512,-1.27; 10 8.28,-1.27; 11 11.049,-1.27; 12 13.792,-1.27; 13 16.561,-1.27; 14 -15.189,1.27; 15 -12.421,1.27; 16 -9.652,1.27; 17 -6.909,1.27; 18 -4.14,1.27; 19 -1.372,1.27; 20 1.372,1.27; 21 4.14,1.27; 22 6.909,1.27; 23 9.652,1.27; 24 12.421,1.27; 25 15.189,1.27 | hole 3.302: -23.52,0; 23.52,0
1X08M = drill 0.914 square: 1 -7,0 | drill 0.914: 2 -5,0; 3 -3,0; 4 -1,0; 5 1,0; 6 3,0; 7 5,0; 8 7,0
B25A- = drill 2.007 pad 5.08 octagon: + -10.338,9.449; +1 -4.75,9.449; - 9.042,-4.343; -1 9.042,-9.931; AC1 9.042,4.343; AC1- 9.042,9.931; AC2 -9.042,-4.343; AC2- -9.042,-9.931 | hole 6.401: 0,0
TO-269AA = smd 1 x 1.25: + -1.28,-2.855; - 1.28,-2.855; AC1 -1.28,2.855; AC2 1.28,2.855
CAPAE830X650N = smd 4.064 x 0.762: 1 -2.87,0; 2 2.87,0
CPOL_RM10 = drill 0.9 pad 1.93 square: + 5,0 | drill 0.9 pad 1.93: - -5,0
SOT223 = smd 1.499 x 2.007: 1 -2.261,-3.15; 2 0.025,-3.15; 3 2.311,-3.15 | smd 3.81 x 2.007: 4 0,3.15
TO252 = smd 1 x 1.6: 1 -2.28,-4.8; 2 2.28,-4.8 | smd 5.4 x 6.2: 3 0,2.5
EI30-1 = drill 1.118 pad 3.81 octagon: 1 -10.008,10.008; 5 -10.008,-10.008; 6 10.008,-10.008; 7 10.008,-5.004; 9 10.008,5.004; 10 10.008,10.008

### Placement (x,y rotation side)
CURRENT_SENS1:C1  1nF  [1206]  69.46,53.58 90 top
CURRENT_SENS1:C2  100nF  [1206]  72.2,60.56 270 top
CURRENT_SENS1:U$1  ACS712  [SO08]  67.94,45.72 0 top
DRIVER1:R1  5k  [1206]  80.64,69.85 270 top
DRIVER1:R2  5k  [1206]  83.18,69.85 270 top
DRIVER1:U$1  VNH2SP30  [VNH2SP30]  80.64,45.72 180 top
LEVEL_TRANSLATOR1:IC1  OPA340N  [SOT23-5]  67.94,60.96 270 top
LEVEL_TRANSLATOR1:R1  1.8k  [1206]  66.46,53.58 270 top
LEVEL_TRANSLATOR1:R2  3.3k  [1206]  67.96,57.58 180 top
LEVEL_TRANSLATOR_POWER1:IC1  OPA340N  [SOT23-5]  124.66,41.44 180 top
LEVEL_TRANSLATOR_POWER1:R1  20k  [1206]  114.98,41.12 270 top
LEVEL_TRANSLATOR_POWER1:R2  1.8k  [1206]  118.48,41.12 90 top
MCU1:A1  [4X10-BOOSTERPACK]  104.14,96.52 270 top
MCU1:JP23  [1X02]  119.38,91.44 180 top
MOTOR1:LSP1  SE14  [SE14]  62.87,43.18 0 top
MOTOR1:LSP2  SE14  [SE14]  92.07,43.18 0 top
PC_LPT1:JP22  [1X04]  131.99,101.13 270 top
PC_LPT1:JP23  [1X02]  125.38,115.53 0 top
PC_LPT1:JP24  [1X02]  114.3,101.6 180 top
PC_LPT1:K1  S202S02  [S202S02]  66.04,111.76 0 top
PC_LPT1:PAD1  [3,81/1,1]  55.88,116.84 0 top
PC_LPT1:PAD2  [3,81/1,1]  66.04,116.84 0 top
PC_LPT1:R1  5k  [1206]  139.08,98.23 0 top
PC_LPT1:R2  5k  [1206]  139.08,101.39 0 top
PC_LPT1:R3  5k  [1206]  139.08,95.06 0 top
PC_LPT1:R4  5k  [1206]  139.72,91.26 0 top
PC_LPT1:R5  5k  [1206]  73.66,116.84 0 top
PC_LPT1:X2  [F25H]  109.25,106.72 0 top
POSITION_ENCODER1:JP1  [1X08M]  123.19,88.9 270 top
POWER_MANAGEMENT1:B1  [B25A-]  118.74,20.96 0 top
POWER_MANAGEMENT1:B2  RECTIFIER-S380  [TO-269AA]  62.23,94.62 90 top
POWER_MANAGEMENT1:C1  220UF  [CAPAE830X650N]  74.13,96.64 90 top
POWER_MANAGEMENT1:C2  100nF  [1206]  67.94,94.62 90 top
POWER_MANAGEMENT1:C3  100nF  [1206]  80.64,87 0 top
POWER_MANAGEMENT1:C4  220UF  [CAPAE830X650N]  67.14,72.52 90 top
POWER_MANAGEMENT1:C5  100nF  [1206]  100.96,31.12 270 top
POWER_MANAGEMENT1:C6  100nF  [1206]  56.52,70.49 180 top
POWER_MANAGEMENT1:C7  220UF  [CAPAE830X650N]  82.79,80.81 0 top
POWER_MANAGEMENT1:C8  100nF  [1206]  79.24,33.02 180 top
POWER_MANAGEMENT1:C10  1000uf/25V  [CPOL_RM10]  93.34,25.4 90 top
POWER_MANAGEMENT1:IC1  REG1117  [SOT223]  73.66,83.82 180 top
POWER_MANAGEMENT1:IC2  7805DT  [TO252]  64.77,85.09 180 top
POWER_MANAGEMENT1:LSP1  SE14  [SE14]  27.3,78.74 180 top
POWER_MANAGEMENT1:LSP2  SE14  [SE14]  27.94,99.06 180 top
POWER_MANAGEMENT1:TOROID_PAD1  SE14  [SE14]  137.16,31.12 0 top
POWER_MANAGEMENT1:TOROID_PAD2  SE14  [SE14]  100.96,10.8 0 top
POWER_MANAGEMENT1:TR1  220/9  [EI30-1]  44.45,88.9 0 top

### Tracks (layer width: path | path; a pad name or v marks a point on that pad's centre or on a via)
3.3V  (via drill 0.5 pad 1.68)
  Top 0.406: DRIVER1:R1.1 DRIVER1:R2.1 | POWER_MANAGEMENT1:IC1.2 73.66,87 | POWER_MANAGEMENT1:C7.1 80.64,80.09
  Top 0.61: 73.66,87 73.66,88.9 74.29,89.54 78.1,89.54 79.24,88.4 POWER_MANAGEMENT1:C3.1 79.92,86.32 POWER_MANAGEMENT1:C7.1
  Top 0.813: 80.64,80.09 v80.64,78.74 | v80.64,73.66 DRIVER1:R1.1
  Bottom 0.813: v80.64,78.74 v80.64,73.66
5V  (via drill 0.5 pad 1.42, 0.5 pad 1.68)  (1 unrouted)
  Top 0.406: LEVEL_TRANSLATOR1:IC1.5 72.15,61.91 CURRENT_SENS1:C2.1 | CURRENT_SENS1:U$1.8 66.04,48.9 65.4,49.53 | 67.31,67.31 67.31,69.22 67.14,69.38 POWER_MANAGEMENT1:C4.1 | 70.48,63.14 v70.48,63.5 | POWER_MANAGEMENT1:IC2.2 62.77,90.17 | LEVEL_TRANSLATOR_POWER1:IC1.5 125.74,40.01 | PC_LPT1:R3.2 141.12,94.43 | PC_LPT1:R4.2 141.3,91.44
  Top 0.61: 62.77,90.17 v64.77,90.17
  Top 0.813: POWER_MANAGEMENT1:C6.1 v61.6,70.49 67.31,70.49 | LEVEL_TRANSLATOR1:IC1.5 70.48,63.14 | 65.4,49.53 v63.5,49.53 | 125.74,40.01 v127.64,40.01
  Top 1.016: PC_LPT1:R2.2 PC_LPT1:R1.2 PC_LPT1:R3.2 | 141.12,94.43 PC_LPT1:R4.2 | 141.3,91.44 v144.78,91.44
  Bottom 0.406: MCU1:JP23.1 120.92,89.9 POSITION_ENCODER1:JP1.4
  pour Bottom (isolate 0.813): 24.13,126.37 24.13,3.81 159.39,3.81 159.39,126.37
CS1  (via drill 0.5 pad 1.68)
  Top 0.406: 104.14,59.69 100.96,62.87 v86.99,62.87 | DRIVER1:U$1.9 79.64,60.6 v81.91,62.87
  Top 1.016: MCU1:A1.36 104.14,59.69
  Bottom 0.406: v81.91,62.87 v86.99,62.87
CURRENT_SENS1:N$1
  Top 0.406: CURRENT_SENS1:U$1.6 68.58,49.62 69.5,50.54 69.5,52.14 CURRENT_SENS1:C1.1
DRIVER1:DIAG_A/EN_A
  Top 0.406: DRIVER1:U$1.6 82.6,54.86 82.6,56.77 84.63,58.8 84.63,65.34 83.18,66.79 DRIVER1:R2.2
DRIVER1:DIAG_B/EN_B
  Top 0.406: 78.6,54.86 DRIVER1:U$1.10 78.64,63.41 80.64,65.41 DRIVER1:R1.2
GND  (via drill 0.5 pad 1.68)  (1 unrouted)
  Top 0.406: 65.4,60.96 LEVEL_TRANSLATOR1:IC1.2 67.31,60.96 67.94,60.33 67.94,59.06 69.36,57.64 LEVEL_TRANSLATOR1:R2.1 | LEVEL_TRANSLATOR_POWER1:IC1.2 124.68,42.76 | LEVEL_TRANSLATOR_POWER1:IC1.2 124.68,42.76 124.68,44.74 | LEVEL_TRANSLATOR_POWER1:IC1.2 124.66,45.52 124.46,45.72
  Bottom 1.422: v85.09,34.29 v78.74,28.58
  pour Top (isolate 0.61): 24.13,126.37 24.13,5.08 160.02,5.08 160.02,126.37
LEVEL_TRANSLATOR1:N$1
  Top 0.406: LEVEL_TRANSLATOR1:R1.1 66.46,57.48 LEVEL_TRANSLATOR1:R2.2 66.56,59.94 LEVEL_TRANSLATOR1:IC1.3
LEVEL_TRANSLATOR_POWER1:N$1
  Top 0.406: LEVEL_TRANSLATOR_POWER1:R2.2 118.71,42.74 LEVEL_TRANSLATOR_POWER1:IC1.3
  Top 1.422: LEVEL_TRANSLATOR_POWER1:R1.1 LEVEL_TRANSLATOR_POWER1:R2.2
MCU1:N$1
  Bottom 1.016: MCU1:A1.21 MCU1:JP23.2
N$1
  Top 0.406: 109.25,101.63 109.22,101.6
  Top 1.016: PC_LPT1:X2.7 109.25,101.63 | 109.22,101.6 MCU1:A1.3
N$2
  Top 1.016: PC_LPT1:X2.6 106.48,101.8 106.68,101.6 MCU1:A1.4
N$3
  Top 1.016: PC_LPT1:X2.4 100.97,102.23 101.6,101.6 MCU1:A1.6
N$4
  Top 1.016: PC_LPT1:X2.5 103.74,102 104.14,101.6 MCU1:A1.5
N$5
  Top 1.016: PC_LPT1:X2.2 95.46,100.12 96.52,99.06 MCU1:A1.8
N$6
  Top 1.016: PC_LPT1:X2.3 98.2,102.46 99.06,101.6 MCU1:A1.7
N$7
  Top 0.406: LEVEL_TRANSLATOR1:IC1.1 67.73,61.91 67.94,61.7 67.94,61.6 69.25,60.29 LEVEL_TRANSLATOR1:IC1.4 | 66.67,61.95 LEVEL_TRANSLATOR1:IC1.1 | 96.52,85.73 86.36,75.57 79.38,75.57 69.85,66.04 68.58,66.04 66.64,64.1 LEVEL_TRANSLATOR1:IC1.1
  Top 1.016: 96.52,85.73 MCU1:A1.28
N$8
  Top 0.406: DRIVER1:U$1.21 78.64,40.51 DRIVER1:U$1.SLUG2 76.05,43.1 75.56,43.1 73.64,45.02 | CURRENT_SENS1:U$1.3 CURRENT_SENS1:U$1.4
  Top 0.61: DRIVER1:U$1.16 73.64,39.84 DRIVER1:U$1.SLUG2 | DRIVER1:U$1.15 73.64,45.02
  Top 1.422: CURRENT_SENS1:U$1.4 75.56,43.1
N$9  (via drill 0.6)  (1 unrouted)
  Top 0.406: 82.64,40.51 DRIVER1:U$1.SLUG3 85.32,43.18 85.72,43.18 87.64,41.26 | DRIVER1:U$1.1 v88.27,52.07
  Top 0.61: 87.64,45.51 85.32,43.18 | 82.64,40.51 DRIVER1:U$1.25 | DRIVER1:U$1.30 87.64,41.26
  Top 1.422: MOTOR1:LSP2.MP 85.72,43.18
  Bottom 0.406: v88.27,52.07 88.27,46.36 91.44,43.18
N$10
  Top 0.406: CURRENT_SENS1:U$1.2 CURRENT_SENS1:U$1.1 65.96,43.18
  Top 1.422: MOTOR1:LSP1.MP 65.96,43.18
N$14
  Top 0.406: CURRENT_SENS1:U$1.7 67.31,50.04 66.5,50.84 66.5,52.14 LEVEL_TRANSLATOR1:R1.2
N$16
  Top 1.016: MCU1:A1.25 104.14,91.44 111.68,83.9 POSITION_ENCODER1:JP1.7
N$17
  Top 1.016: MCU1:A1.23 109.22,91.44 112.76,87.9 POSITION_ENCODER1:JP1.5
N$21
  Top 1.016: MCU1:A1.26 101.6,91.44 111.14,81.9 POSITION_ENCODER1:JP1.8
N$22
  Top 1.016: MCU1:A1.24 106.68,91.44 112.22,85.9 POSITION_ENCODER1:JP1.6
OUT_A1
  Top 0.406: 101.6,56.52 100.96,57.15 84.45,57.15 83.64,56.34 DRIVER1:U$1.5
  Top 1.016: MCU1:A1.35 101.6,56.52
OUT_B1  (via drill 0.5 pad 1.68)
  Top 0.406: DRIVER1:U$1.11 77.64,65.58 v78.1,66.04 | v86.99,66.04 103.5,66.04 106.68,62.87
  Top 1.016: MCU1:A1.37 106.68,62.87
  Bottom 0.406: v78.1,66.04 v86.99,66.04
PC_LPT1:N$12
  Top 1.016: PC_LPT1:X2.10 116.84,104.76 116.84,101.6 120.65,97.79 124.46,97.79 128.74,93.51 PC_LPT1:JP22.4 134.24,91.26 PC_LPT1:R4.1
PC_LPT1:N$28
  Top 0.406: 130.97,96.05 131.45,96.05 PC_LPT1:JP22.3
  Top 1.016: PC_LPT1:X2.11 119.38,104.53 119.38,101.6 121.28,99.7 125.73,99.7 129.38,96.05 131.45,96.05 | PC_LPT1:JP22.3 132.98,95.06 PC_LPT1:R3.1
PC_LPT1:N$31
  Top 0.406: 130.97,98.59 PC_LPT1:JP22.2
  Top 1.016: PC_LPT1:X2.12 121.92,104.33 121.92,102.24 122.55,101.6 127,101.6 130.01,98.59 PC_LPT1:JP22.2 132.36,98.23 PC_LPT1:R1.1
PC_LPT1:N$34
  Top 0.406: 130.97,101.13 PC_LPT1:JP22.1 132.25,101.39
  Top 0.813: 127.76,103.51 130.13,101.13 PC_LPT1:JP22.1
  Top 1.016: PC_LPT1:X2.13 127.76,103.51 | 132.25,101.39 PC_LPT1:R2.1
PC_LPT1:N$41
  Top 1.93: PC_LPT1:R5.1 71.12,115.7 PC_LPT1:K1.3
PC_LPT1:N$42
  Top 1.93: PC_LPT1:R5.2 93.98,116.84 96.83,113.99 PC_LPT1:X2.15
PC_LPT1:N$43
  Top 1.93: PC_LPT1:K1.2 66.04,114.3 PC_LPT1:PAD2.1
PC_LPT1:N$44
  Top 1.93: PC_LPT1:PAD1.1 58.42,114.3 PC_LPT1:K1.1
PC_LPT1:N$45  (1 unrouted)
PC_LPT1:N$46  (1 unrouted)
PC_LPT1:PRE_GND
  Top 1.016: PC_LPT1:JP23.1 125.38,108.93 PC_LPT1:X2.25 PC_LPT1:X2.24 PC_LPT1:X2.23 PC_LPT1:X2.22 PC_LPT1:X2.21 PC_LPT1:X2.20 PC_LPT1:X2.19 PC_LPT1:X2.18
POWER_MANAGEMENT1:N$1
  Top 1.93: POWER_MANAGEMENT1:B1.AC2- 109.47,10.8 POWER_MANAGEMENT1:TOROID_PAD2.MP
POWER_MANAGEMENT1:N$2
  Top 1.93: POWER_MANAGEMENT1:B1.AC1- 128.02,31.12 POWER_MANAGEMENT1:TOROID_PAD1.MP
POWER_MANAGEMENT1:N$3
  Top 0.61: 59.38,88.81 POWER_MANAGEMENT1:B2.AC1
  Top 1.93: POWER_MANAGEMENT1:TR1.7 59.38,88.81
POWER_MANAGEMENT1:N$4
  Top 1.93: POWER_MANAGEMENT1:TR1.9 56.45,95.9 POWER_MANAGEMENT1:B2.AC2
POWER_MANAGEMENT1:N$7
  Top 1.422: POWER_MANAGEMENT1:LSP2.MP 28.09,98.91 POWER_MANAGEMENT1:TR1.1
POWER_MANAGEMENT1:N$8
  Top 1.422: POWER_MANAGEMENT1:LSP1.MP 27.46,78.89 POWER_MANAGEMENT1:TR1.5
POWER_MANAGEMENT1:REC9V  (1 unrouted)
  Top 0.406: POWER_MANAGEMENT1:B2.+ 65.2,93.22 | 68.07,93.35 POWER_MANAGEMENT1:C2.1 67.05,92.32
  Top 0.61: 65.2,93.22 POWER_MANAGEMENT1:C2.1 | 68.07,93.35 74.29,93.35 | 67.05,92.32 POWER_MANAGEMENT1:IC2.1 69.97,86.97 POWER_MANAGEMENT1:IC1.3
PWM1  (via drill 0.5 pad 1.68)
  Top 0.406: DRIVER1:U$1.8 80.6,54.86 80.6,57.34 81.2,57.94 v81.3,57.94
  Bottom 0.406: v81.3,57.94 83,59.64 108.08,59.64 109.22,58.5
  Bottom 1.016: 109.22,58.5 MCU1:A1.38
VCC
  Top 0.406: DRIVER1:U$1.SLUG1 80.64,48.26 81.28,48.26 | 78.61,50.8 78.1,50.8 | 114.64,39.72 LEVEL_TRANSLATOR_POWER1:R1.2 | 81.28,48.26 91.44,48.26 99.06,40.64 99.06,35.56 101.6,33.02 99.06,33.02 | 85.64,53.26 85.64,52.63 81.28,48.26
  Top 0.61: 80.64,48.26 DRIVER1:U$1.23 POWER_MANAGEMENT1:C8.1 | 75.64,53.26 DRIVER1:U$1.13 | DRIVER1:U$1.3 85.64,53.26
  Top 0.813: DRIVER1:U$1.SLUG1 78.61,50.8 | 78.1,50.8 75.64,53.26
  Top 2.54: POWER_MANAGEMENT1:B1.+1 111.84,30.4 108.58,33.66 | 108.58,33.66 102.1,33.66 POWER_MANAGEMENT1:C5.1 97.36,32.52 POWER_MANAGEMENT1:C10.+ 83.27,30.4 POWER_MANAGEMENT1:C8.1 | 108.58,33.66 114.64,39.72
VCC_SENSE
  Top 0.406: LEVEL_TRANSLATOR_POWER1:IC1.4 125.61,42.03 LEVEL_TRANSLATOR_POWER1:IC1.1 125.73,42.86 125.73,47.63
  Top 1.016: MCU1:A1.27 99.06,90.36 119.38,70.04 119.38,53.98 125.73,47.63